# Altium project ZYNQ7020.PrjPcb (part 2 of 3)

## Sheet DDR.SchDoc
size A3
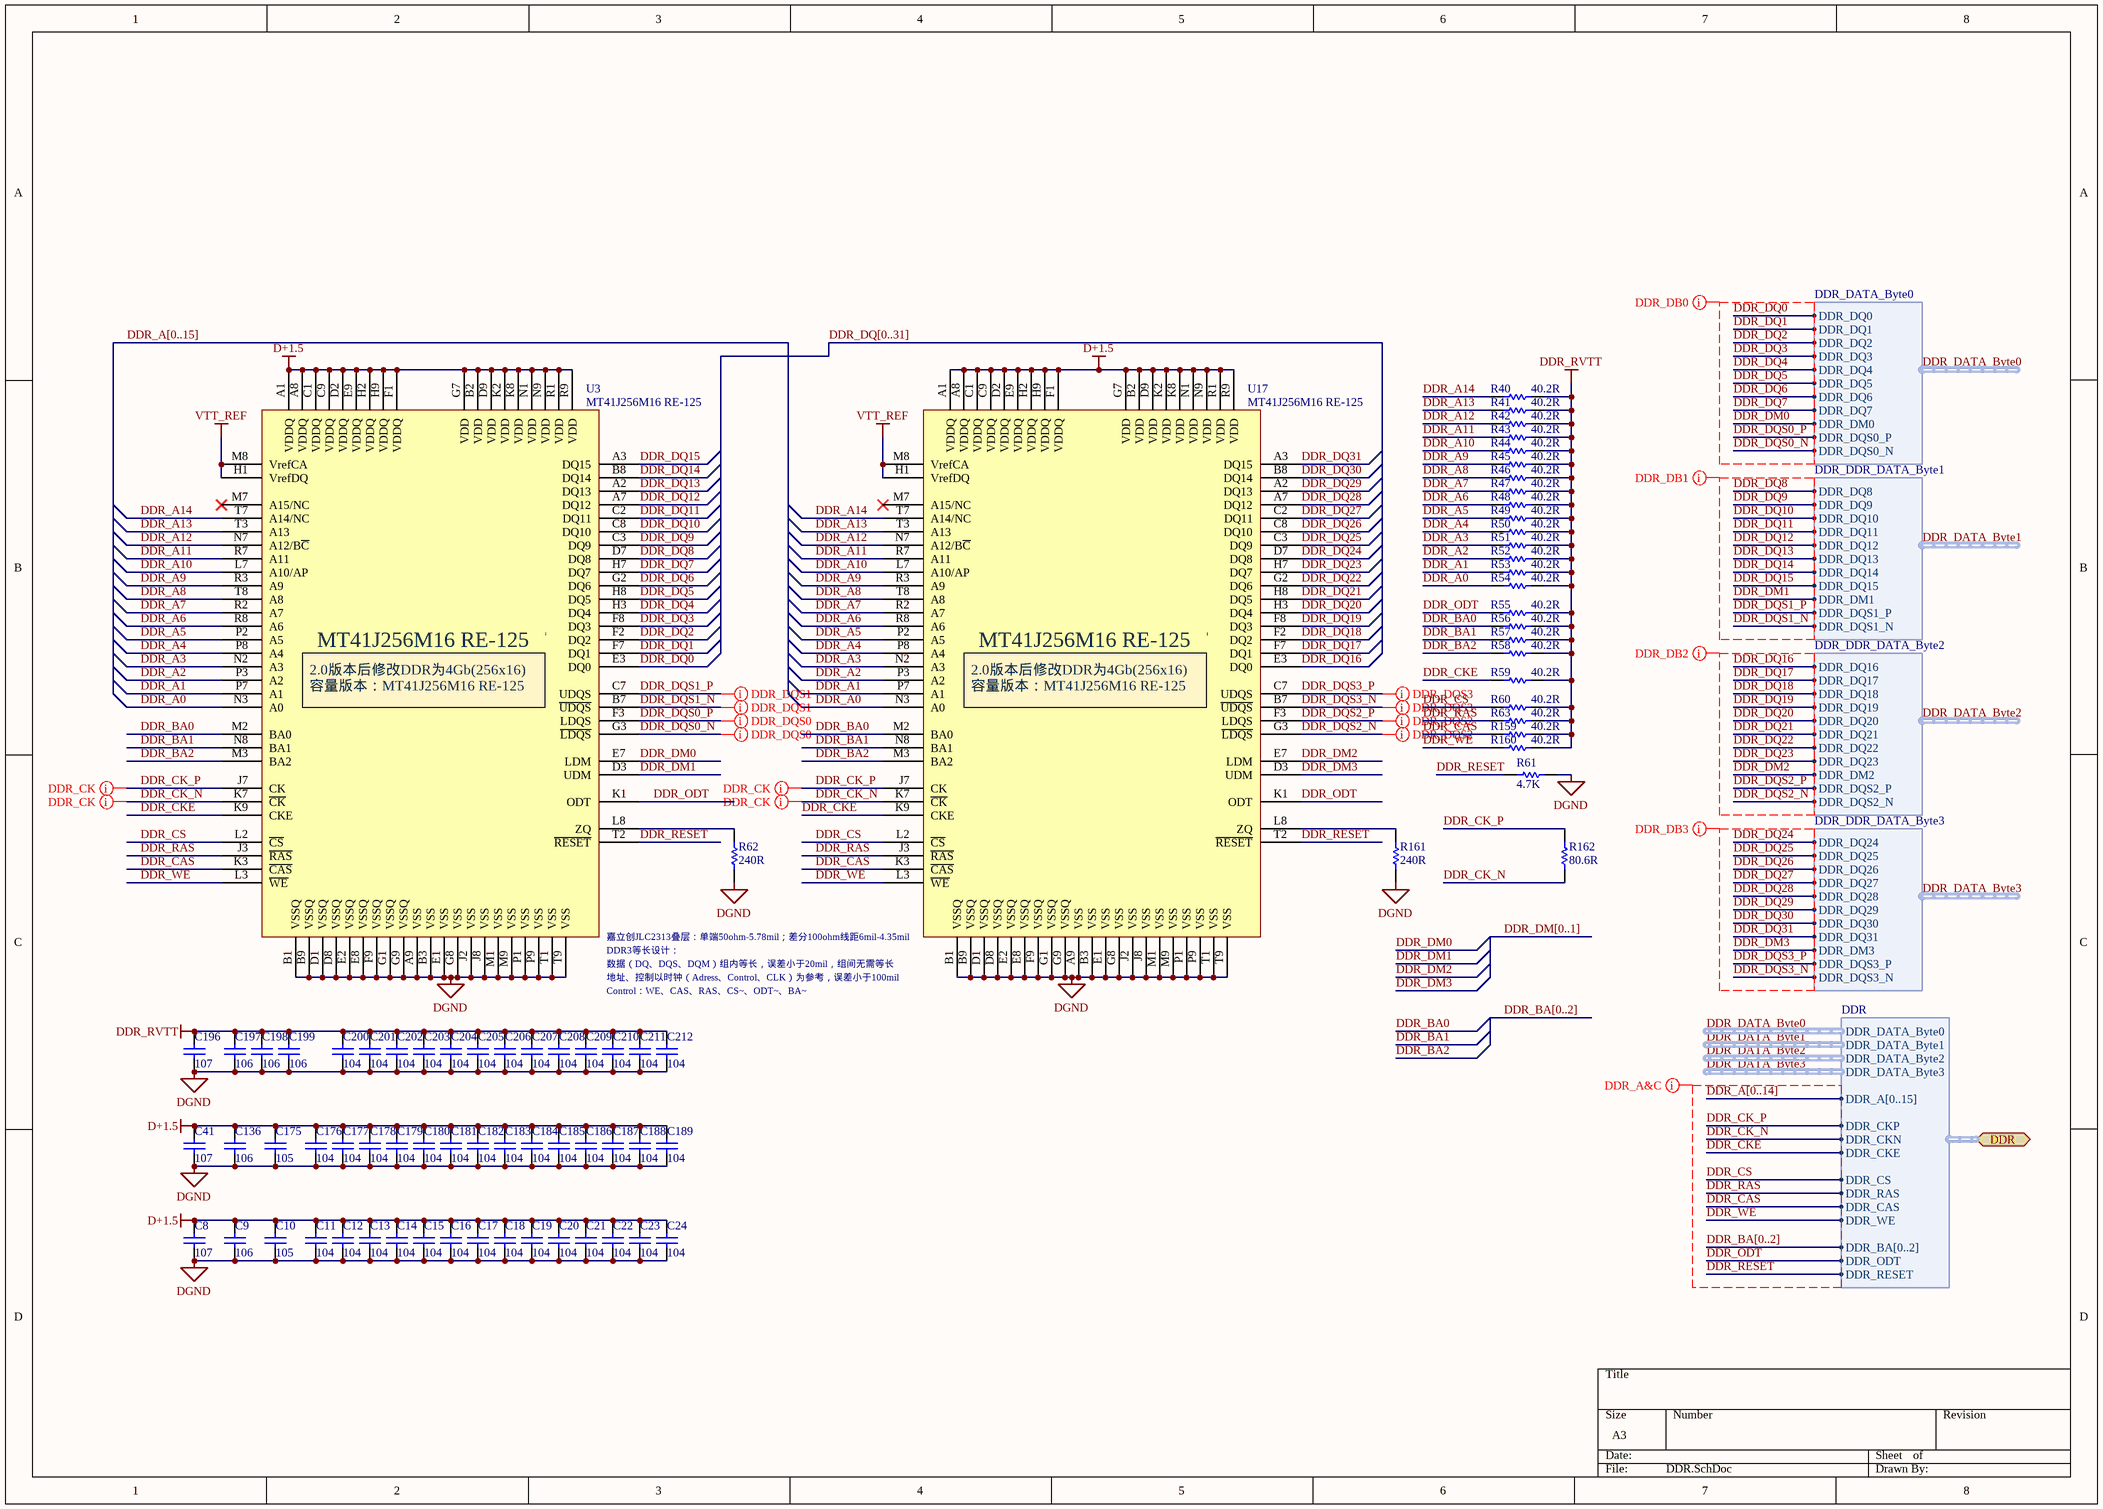
[diagram p8: DDR.SchDoc]

### Parts
C8  107  [C 1206_L]
C9  106  [C 0603_L]
C10  105  [C 0603_L]
C11  104  [C 0402_LL]
C12  104  [C 0402_LL]
C13  104  [C 0402_LL]
C14  104  [C 0402_LL]
C15  104  [C 0402_LL]
C16  104  [C 0402_LL]
C17  104  [C 0402_LL]
C18  104  [C 0402_LL]
C19  104  [C 0402_LL]
C20  104  [C 0402_LL]
C21  104  [C 0402_LL]
C22  104  [C 0402_LL]
C23  104  [C 0402_LL]
C24  104  [C 0402_LL]
C41  107  [C 1206_L]
C136  106  [C 0603_L]
C175  105  [C 0603_L]
C176  104  [C 0402_LL]
C177  104  [C 0402_LL]
C178  104  [C 0402_LL]
C179  104  [C 0402_LL]
C180  104  [C 0402_LL]
C181  104  [C 0402_LL]
C182  104  [C 0402_LL]
C183  104  [C 0402_LL]
C184  104  [C 0402_LL]
C185  104  [C 0402_LL]
C186  104  [C 0402_LL]
C187  104  [C 0402_LL]
C188  104  [C 0402_LL]
C189  104  [C 0402_LL]
C196  107  [C 1206_L]
C197  106  [C 0603_L]
C198  106  [C 0603_L]
C199  106  [C 0603_L]
C200  104  [C 0402_LL]
C201  104  [C 0402_LL]
C202  104  [C 0402_LL]
C203  104  [C 0402_LL]
C204  104  [C 0402_LL]
C205  104  [C 0402_LL]
C206  104  [C 0402_LL]
C207  104  [C 0402_LL]
C208  104  [C 0402_LL]
C209  104  [C 0402_LL]
C210  104  [C 0402_LL]
C211  104  [C 0402_LL]
C212  104  [C 0402_LL]
R40  40.2R  [R 0402_L]
R41  40.2R  [R 0402_L]
R42  40.2R  [R 0402_L]
R43  40.2R  [R 0402_L]
R44  40.2R  [R 0402_L]
R45  40.2R  [R 0402_L]
R46  40.2R  [R 0402_L]
R47  40.2R  [R 0402_L]
R48  40.2R  [R 0402_L]
R49  40.2R  [R 0402_L]
R50  40.2R  [R 0402_L]
R51  40.2R  [R 0402_L]
R52  40.2R  [R 0402_L]
R53  40.2R  [R 0402_L]
R54  40.2R  [R 0402_L]
R55  40.2R  [R 0402_L]
R56  40.2R  [R 0402_L]
R57  40.2R  [R 0402_L]
R58  40.2R  [R 0402_L]
R59  40.2R  [R 0402_L]
R60  40.2R  [R 0402_L]
R61  4.7K  [R 0402_L]
R62  240R  [R 0603_L]
R63  40.2R  [R 0402_L]
R159  40.2R  [R 0402_L]
R160  40.2R  [R 0402_L]
R161  240R  [R 0603_L]
R162  80.6R  [R 0402_L]
U3  MT41J256M16 RE-125  [FBGA96]
U17  MT41J256M16 RE-125  [FBGA96]

### Ports
DDR (bidir, harness DDR)

### Harnesses
DDR: DDR_A[0..15], DDR_CKP, DDR_CKN, DDR_CKE, DDR_CS, DDR_RAS, DDR_CAS, DDR_WE, DDR_DATA_Byte0, DDR_DATA_Byte1, DDR_DATA_Byte2, DDR_DATA_Byte3, DDR_BA[0..2], DDR_ODT, DDR_RESET
DDR_DDR_DATA_Byte3: DDR_DQ24, DDR_DQ25, DDR_DQ26, DDR_DQ27, DDR_DQ28, DDR_DQ29, DDR_DQ30, DDR_DQ31, DDR_DM3, DDR_DQS3_P, DDR_DQS3_N
DDR_DDR_DATA_Byte2: DDR_DQ16, DDR_DQ17, DDR_DQ18, DDR_DQ19, DDR_DQ20, DDR_DQ21, DDR_DQ22, DDR_DQ23, DDR_DM2, DDR_DQS2_P, DDR_DQS2_N
DDR_DDR_DATA_Byte1: DDR_DQ8, DDR_DQ9, DDR_DQ10, DDR_DQ11, DDR_DQ12, DDR_DQ13, DDR_DQ14, DDR_DQ15, DDR_DM1, DDR_DQS1_P, DDR_DQS1_N
DDR_DATA_Byte0: DDR_DQ0, DDR_DQ1, DDR_DQ2, DDR_DQ3, DDR_DQ4, DDR_DQ5, DDR_DQ6, DDR_DQ7, DDR_DM0, DDR_DQS0_P, DDR_DQS0_N

### Nets
D+1.5: C8.2 C9.2 C10.2 C11.2 C12.2 C13.2 C14.2 C15.2 C16.2 C17.2 C18.2 C19.2 C20.2 C21.2 C22.2 C23.2 C24.2 C41.2 C136.2 C175.2 C176.2 C177.2 C178.2 C179.2 C180.2 C181.2 C182.2 C183.2 C184.2 C185.2 C186.2 C187.2 C188.2 C189.2 U3.A1(VDDQ) U3.A8(VDDQ) U3.B2(VDD) U3.C1(VDDQ) U3.C9(VDDQ) U3.D2(VDDQ) U3.D9(VDD) U3.E9(VDDQ) U3.F1(VDDQ) U3.G7(VDD) U3.H2(VDDQ) U3.H9(VDDQ) U3.K2(VDD) U3.K8(VDD) U3.N1(VDD) U3.N9(VDD) U3.R1(VDD) U3.R9(VDD) U17.A1(VDDQ) U17.A8(VDDQ) U17.B2(VDD) U17.C1(VDDQ) U17.C9(VDDQ) U17.D2(VDDQ) U17.D9(VDD) U17.E9(VDDQ) U17.F1(VDDQ) U17.G7(VDD) U17.H2(VDDQ) U17.H9(VDDQ) U17.K2(VDD) U17.K8(VDD) U17.N1(VDD) U17.N9(VDD) U17.R1(VDD) U17.R9(VDD)
DDR_RVTT: C196.2 C197.2 C198.2 C199.2 C200.2 C201.2 C202.2 C203.2 C204.2 C205.2 C206.2 C207.2 C208.2 C209.2 C210.2 C211.2 C212.2 R40.2 R41.2 R42.2 R43.2 R44.2 R45.2 R46.2 R47.2 R48.2 R49.2 R50.2 R51.2 R52.2 R53.2 R54.2 R55.1 R56.2 R57.2 R58.2 R59.2 R60.2 R63.2 R159.2 R160.2
DGND: C8.1 C9.1 C10.1 C11.1 C12.1 C13.1 C14.1 C15.1 C16.1 C17.1 C18.1 C19.1 C20.1 C21.1 C22.1 C23.1 C24.1 C41.1 C136.1 C175.1 C176.1 C177.1 C178.1 C179.1 C180.1 C181.1 C182.1 C183.1 C184.1 C185.1 C186.1 C187.1 C188.1 C189.1 C196.1 C197.1 C198.1 C199.1 C200.1 C201.1 C202.1 C203.1 C204.1 C205.1 C206.1 C207.1 C208.1 C209.1 C210.1 C211.1 C212.1 R61.1 R62.1 R161.1 U3.A9(VSS) U3.B1(VSSQ) U3.B3(VSS) U3.B9(VSSQ) U3.D1(VSSQ) U3.D8(VSSQ) U3.E1(VSS) U3.E2(VSSQ) U3.E8(VSSQ) U3.F9(VSSQ) U3.G1(VSSQ) U3.G8(VSS) U3.G9(VSSQ) U3.J2(VSS) U3.J8(VSS) U3.M1(VSS) U3.M9(VSS) U3.P1(VSS) U3.P9(VSS) U3.T1(VSS) U3.T9(VSS) U17.A9(VSS) U17.B1(VSSQ) U17.B3(VSS) U17.B9(VSSQ) U17.D1(VSSQ) U17.D8(VSSQ) U17.E1(VSS) U17.E2(VSSQ) U17.E8(VSSQ) U17.F9(VSSQ) U17.G1(VSSQ) U17.G8(VSS) U17.G9(VSSQ) U17.J2(VSS) U17.J8(VSS) U17.M1(VSS) U17.M9(VSS) U17.P1(VSS) U17.P9(VSS) U17.T1(VSS) U17.T9(VSS)
VTT_REF: U3.H1(VrefDQ) U3.M8(VrefCA) U17.H1(VrefDQ) U17.M8(VrefCA)
DDR_A0: R54.1 U3.N3(A0) U17.N3(A0)
DDR_A1: R53.1 U3.P7(A1) U17.P7(A1)
DDR_A2: R52.1 U3.P3(A2) U17.P3(A2)
DDR_A3: R51.1 U3.N2(A3) U17.N2(A3)
DDR_A4: R50.1 U3.P8(A4) U17.P8(A4)
DDR_A5: R49.1 U3.P2(A5) U17.P2(A5)
DDR_A6: R48.1 U3.R8(A6) U17.R8(A6)
DDR_A7: R47.1 U3.R2(A7) U17.R2(A7)
DDR_A8: R46.1 U3.T8(A8) U17.T8(A8)
DDR_A9: R45.1 U3.R3(A9) U17.R3(A9)
DDR_A10: R44.1 U3.L7(A10/AP) U17.L7(A10/AP)
DDR_A11: R43.1 U3.R7(A11) U17.R7(A11)
DDR_A12: R42.1 U3.N7(A12/B~{C}) U17.N7(A12/B~{C})
DDR_A13: R41.1 U3.T3(A13) U17.T3(A13)
DDR_A14: R40.1 U3.T7(A14/NC) U17.T7(A14/NC)
DDR_BA0: R56.1 U3.M2(BA0) U17.M2(BA0)
DDR_BA1: R57.1 U3.N8(BA1) U17.N8(BA1)
DDR_BA2: R58.1 U3.M3(BA2) U17.M3(BA2)
DDR_CAS: R159.1 U3.K3(~{CAS}) U17.K3(~{CAS}) ; port DDR.DDR_CAS
DDR_CK_N: R162.2 U3.K7(~{CK}) U17.K7(~{CK}) ; port DDR.DDR_CKN
DDR_CK_P: R162.1 U3.J7(CK) U17.J7(CK) ; port DDR.DDR_CKP
DDR_CKE: R59.1 U3.K9(CKE) U17.K9(CKE) ; port DDR.DDR_CKE
DDR_CS: R60.1 U3.L2(~{CS}) U17.L2(~{CS}) ; port DDR.DDR_CS
DDR_DM0: U3.E7(LDM) ; harness DDR_DATA_Byte0.DDR_DM0  [project net DDR_DATA_Byte0.DDR_DM0]
DDR_DM1: U3.D3(UDM) ; harness DDR_DDR_DATA_Byte1.DDR_DM1  [project net DDR_DATA_Byte1.DDR_DM1]
DDR_DM2: U17.E7(LDM) ; harness DDR_DDR_DATA_Byte2.DDR_DM2  [project net DDR_DATA_Byte2.DDR_DM2]
DDR_DM3: U17.D3(UDM) ; harness DDR_DDR_DATA_Byte3.DDR_DM3  [project net DDR_DATA_Byte3.DDR_DM3]
DDR_DQ0: U3.E3(DQ0) ; harness DDR_DATA_Byte0.DDR_DQ0  [project net DDR_DATA_Byte0.DDR_DQ0]
DDR_DQ1: U3.F7(DQ1) ; harness DDR_DATA_Byte0.DDR_DQ1  [project net DDR_DATA_Byte0.DDR_DQ1]
DDR_DQ2: U3.F2(DQ2) ; harness DDR_DATA_Byte0.DDR_DQ2  [project net DDR_DATA_Byte0.DDR_DQ2]
DDR_DQ3: U3.F8(DQ3) ; harness DDR_DATA_Byte0.DDR_DQ3  [project net DDR_DATA_Byte0.DDR_DQ3]
DDR_DQ4: U3.H3(DQ4) ; harness DDR_DATA_Byte0.DDR_DQ4  [project net DDR_DATA_Byte0.DDR_DQ4]
DDR_DQ5: U3.H8(DQ5) ; harness DDR_DATA_Byte0.DDR_DQ5  [project net DDR_DATA_Byte0.DDR_DQ5]
DDR_DQ6: U3.G2(DQ6) ; harness DDR_DATA_Byte0.DDR_DQ6  [project net DDR_DATA_Byte0.DDR_DQ6]
DDR_DQ7: U3.H7(DQ7) ; harness DDR_DATA_Byte0.DDR_DQ7  [project net DDR_DATA_Byte0.DDR_DQ7]
DDR_DQ8: U3.D7(DQ8) ; harness DDR_DDR_DATA_Byte1.DDR_DQ8  [project net DDR_DATA_Byte1.DDR_DQ8]
DDR_DQ9: U3.C3(DQ9) ; harness DDR_DDR_DATA_Byte1.DDR_DQ9  [project net DDR_DATA_Byte1.DDR_DQ9]
DDR_DQ10: U3.C8(DQ10) ; harness DDR_DDR_DATA_Byte1.DDR_DQ10  [project net DDR_DATA_Byte1.DDR_DQ10]
DDR_DQ11: U3.C2(DQ11) ; harness DDR_DDR_DATA_Byte1.DDR_DQ11  [project net DDR_DATA_Byte1.DDR_DQ11]
DDR_DQ12: U3.A7(DQ12) ; harness DDR_DDR_DATA_Byte1.DDR_DQ12  [project net DDR_DATA_Byte1.DDR_DQ12]
DDR_DQ13: U3.A2(DQ13) ; harness DDR_DDR_DATA_Byte1.DDR_DQ13  [project net DDR_DATA_Byte1.DDR_DQ13]
DDR_DQ14: U3.B8(DQ14) ; harness DDR_DDR_DATA_Byte1.DDR_DQ14  [project net DDR_DATA_Byte1.DDR_DQ14]
DDR_DQ15: U3.A3(DQ15) ; harness DDR_DDR_DATA_Byte1.DDR_DQ15  [project net DDR_DATA_Byte1.DDR_DQ15]
DDR_DQ16: U17.E3(DQ0) ; harness DDR_DDR_DATA_Byte2.DDR_DQ16  [project net DDR_DATA_Byte2.DDR_DQ16]
DDR_DQ17: U17.F7(DQ1) ; harness DDR_DDR_DATA_Byte2.DDR_DQ17  [project net DDR_DATA_Byte2.DDR_DQ17]
DDR_DQ18: U17.F2(DQ2) ; harness DDR_DDR_DATA_Byte2.DDR_DQ18  [project net DDR_DATA_Byte2.DDR_DQ18]
DDR_DQ19: U17.F8(DQ3) ; harness DDR_DDR_DATA_Byte2.DDR_DQ19  [project net DDR_DATA_Byte2.DDR_DQ19]
DDR_DQ20: U17.H3(DQ4) ; harness DDR_DDR_DATA_Byte2.DDR_DQ20  [project net DDR_DATA_Byte2.DDR_DQ20]
DDR_DQ21: U17.H8(DQ5) ; harness DDR_DDR_DATA_Byte2.DDR_DQ21  [project net DDR_DATA_Byte2.DDR_DQ21]
DDR_DQ22: U17.G2(DQ6) ; harness DDR_DDR_DATA_Byte2.DDR_DQ22  [project net DDR_DATA_Byte2.DDR_DQ22]
DDR_DQ23: U17.H7(DQ7) ; harness DDR_DDR_DATA_Byte2.DDR_DQ23  [project net DDR_DATA_Byte2.DDR_DQ23]
DDR_DQ24: U17.D7(DQ8) ; harness DDR_DDR_DATA_Byte3.DDR_DQ24  [project net DDR_DATA_Byte3.DDR_DQ24]
DDR_DQ25: U17.C3(DQ9) ; harness DDR_DDR_DATA_Byte3.DDR_DQ25  [project net DDR_DATA_Byte3.DDR_DQ25]
DDR_DQ26: U17.C8(DQ10) ; harness DDR_DDR_DATA_Byte3.DDR_DQ26  [project net DDR_DATA_Byte3.DDR_DQ26]
DDR_DQ27: U17.C2(DQ11) ; harness DDR_DDR_DATA_Byte3.DDR_DQ27  [project net DDR_DATA_Byte3.DDR_DQ27]
DDR_DQ28: U17.A7(DQ12) ; harness DDR_DDR_DATA_Byte3.DDR_DQ28  [project net DDR_DATA_Byte3.DDR_DQ28]
DDR_DQ29: U17.A2(DQ13) ; harness DDR_DDR_DATA_Byte3.DDR_DQ29  [project net DDR_DATA_Byte3.DDR_DQ29]
DDR_DQ30: U17.B8(DQ14) ; harness DDR_DDR_DATA_Byte3.DDR_DQ30  [project net DDR_DATA_Byte3.DDR_DQ30]
DDR_DQ31: U17.A3(DQ15) ; harness DDR_DDR_DATA_Byte3.DDR_DQ31  [project net DDR_DATA_Byte3.DDR_DQ31]
DDR_DQS0_N: U3.G3(~{LDQS}) ; harness DDR_DATA_Byte0.DDR_DQS0_N  [project net DDR_DATA_Byte0.DDR_DQS0_N]
DDR_DQS0_P: U3.F3(LDQS) ; harness DDR_DATA_Byte0.DDR_DQS0_P  [project net DDR_DATA_Byte0.DDR_DQS0_P]
DDR_DQS1_N: U3.B7(~{UDQS}) ; harness DDR_DDR_DATA_Byte1.DDR_DQS1_N  [project net DDR_DATA_Byte1.DDR_DQS1_N]
DDR_DQS1_P: U3.C7(UDQS) ; harness DDR_DDR_DATA_Byte1.DDR_DQS1_P  [project net DDR_DATA_Byte1.DDR_DQS1_P]
DDR_DQS2_N: U17.G3(~{LDQS}) ; harness DDR_DDR_DATA_Byte2.DDR_DQS2_N  [project net DDR_DATA_Byte2.DDR_DQS2_N]
DDR_DQS2_P: U17.F3(LDQS) ; harness DDR_DDR_DATA_Byte2.DDR_DQS2_P  [project net DDR_DATA_Byte2.DDR_DQS2_P]
DDR_DQS3_N: U17.B7(~{UDQS}) ; harness DDR_DDR_DATA_Byte3.DDR_DQS3_N  [project net DDR_DATA_Byte3.DDR_DQS3_N]
DDR_DQS3_P: U17.C7(UDQS) ; harness DDR_DDR_DATA_Byte3.DDR_DQS3_P  [project net DDR_DATA_Byte3.DDR_DQS3_P]
DDR_ODT: R55.2 U3.K1(ODT) U17.K1(ODT) ; port DDR.DDR_ODT
DDR_RAS: R63.1 U3.J3(~{RAS}) U17.J3(~{RAS}) ; port DDR.DDR_RAS
DDR_RESET: R61.2 U3.T2(~{RESET}) U17.T2(~{RESET}) ; port DDR.DDR_RESET
DDR_WE: R160.1 U3.L3(~{WE}) U17.L3(~{WE}) ; port DDR.DDR_WE
NetR62_2: R62.2 U3.L8(ZQ)
NetR161_2: R161.2 U17.L8(ZQ)

Not connected (* = marked no-connect by the designer): U3 J1 J9 L1 L9 M7(A15/NC)*; U17 J1 J9 L1 L9 M7(A15/NC)*

### Buses and harness runs
bus DDR_A[0..14]
bus DDR_A[0..15]
bus DDR_BA[0..2]
bus DDR_DM[0..1]
bus DDR_DQ[0..31]

### Layout directives
differential pair; differential pair class DDR_DQS1: DDR_DATA_Byte1.DDR_DQS1_N, DDR_DATA_Byte1.DDR_DQS1_P
differential pair; differential pair class DDR_DQS3: DDR_DATA_Byte3.DDR_DQS3_N, DDR_DATA_Byte3.DDR_DQS3_P
differential pair; differential pair class DDR_DQS0: DDR_CK_N, DDR_CK_P, DDR_DATA_Byte0.DDR_DQS0_N, DDR_DATA_Byte0.DDR_DQS0_P
differential pair; differential pair class DDR_DQS2: DDR_DATA_Byte2.DDR_DQS2_N, DDR_DATA_Byte2.DDR_DQS2_P
net class DDR_DB0: DDR_DM0, DDR_DQ0, DDR_DQ1, DDR_DQ2, DDR_DQ3, DDR_DQ4, DDR_DQ5, DDR_DQ6, DDR_DQ7, DDR_DQS0_N, DDR_DQS0_P
net class DDR_DB1: DDR_DM1, DDR_DQ8, DDR_DQ9, DDR_DQ10, DDR_DQ11, DDR_DQ12, DDR_DQ13, DDR_DQ14, DDR_DQ15, DDR_DQS1_N, DDR_DQS1_P
net class DDR_DB2: DDR_DM2, DDR_DQ16, DDR_DQ17, DDR_DQ18, DDR_DQ19, DDR_DQ20, DDR_DQ21, DDR_DQ22, DDR_DQ23, DDR_DQS2_N, DDR_DQS2_P
net class DDR_DB3: DDR_DM3, DDR_DQ24, DDR_DQ25, DDR_DQ26, DDR_DQ27, DDR_DQ28, DDR_DQ29, DDR_DQ30, DDR_DQ31, DDR_DQS3_N, DDR_DQS3_P
net class DDR_A&C: DDR_A[0..14], DDR_BA[0..2], DDR_CAS, DDR_CK_N, DDR_CK_P, DDR_CKE, DDR_CS, DDR_ODT, DDR_RAS, DDR_RESET, DDR_WE

### Notes on the sheet
- (near U3) MT41J256M16 RE-125
- (near U17) MT41J256M16 RE-125
- (near U3) 2.0版本后修改DDR为4Gb(256x16)容量版本：MT41J256M16 RE-125
- (near U17) 2.0版本后修改DDR为4Gb(256x16)容量版本：MT41J256M16 RE-125
- (near U3) 嘉立创JLC2313叠层：单端50ohm-5.78mil；差分100ohm线距6mil-4.35mil
- (near U3) DDR3等长设计：
- (near U3) 数据（DQ、DQS、DQM）组内等长，误差小于20mil，组间无需等长
- (near U3) 地址、控制以时钟（Adress、Control、CLK）为参考，误差小于100mil
- Control：WE、CAS、RAS、CS~、ODT~、BA~

### Library data of the parts
C8-C24 C41 C136 C175-C189 C196-C212 = Cap: Capacitor; Published: 8-Jun-2000; LatestRevisionDate: 17-Jul-2002; LatestRevisionNote: Re-released for DXP Platform.; PackageReference: RAD-0.3; Publisher: Altium Limited; PackageDescription: Radial Cap, Thru-Hole; 2 Leads; 0.3 in Pin Spacing
R40-R63 R159-R162 = Res1: Resistor; Value: 1K; Published: 8-Jun-2000; LatestRevisionDate: 17-Jul-2002; LatestRevisionNote: Re-released for DXP Platform.; PackageReference: AXIAL-0.3; Publisher: Altium Limited; PackageDescription: Axial Device, Thru-Hole; 2 Leads; 0.3 in Pin Spacing
U3 U17 = MT41J128M16HA-125 IT: DDR3，存储芯片; Manufacturer: Micron; value: NC

## Sheet Human_Interface.SchDoc
size A4
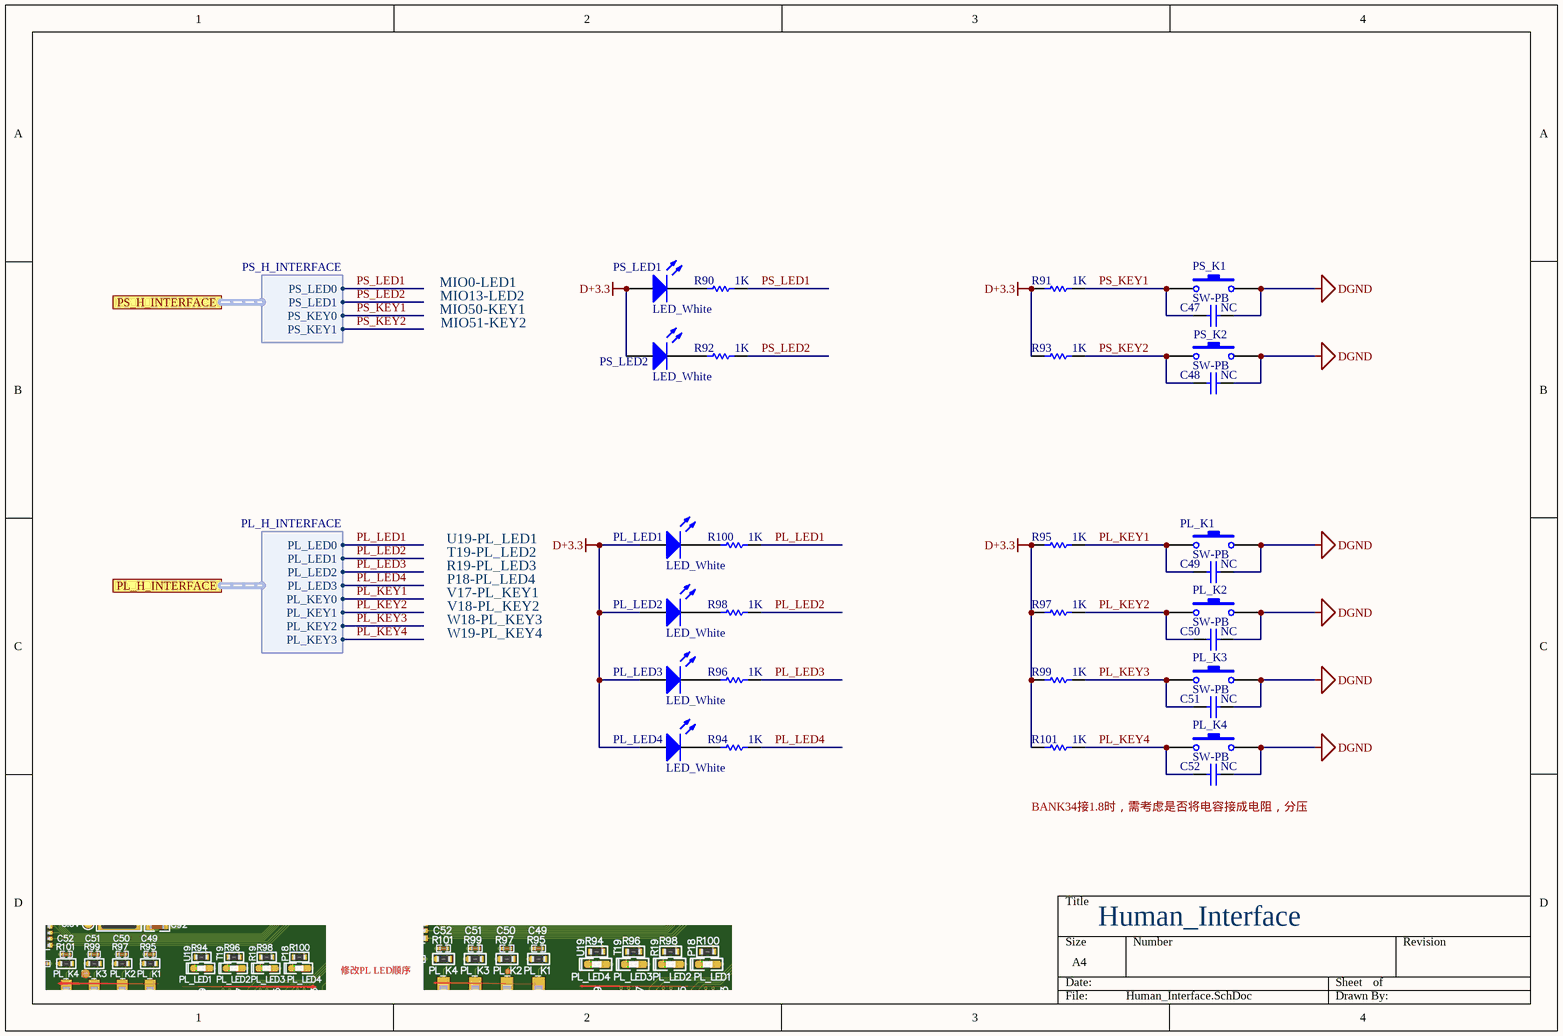
[diagram p9: Human_Interface.SchDoc]

### Parts
C47  NC  [C 0402_LL]
C48  NC  [C 0402_LL]
C49  NC  [C 0402_LL]
C50  NC  [C 0402_LL]
C51  NC  [C 0402_LL]
C52  NC  [C 0402_LL]
PL_K1  SW-PB  [TSW SMD-3*6*4.3]
PL_K2  SW-PB  [TSW SMD-3*6*4.3]
PL_K3  SW-PB  [TSW SMD-3*6*4.3]
PL_K4  SW-PB  [TSW SMD-3*6*4.3]
PL_LED1  LED_White  [LED 0603W]
PL_LED2  LED_White  [LED 0603W]
PL_LED3  LED_White  [LED 0603W]
PL_LED4  LED_White  [LED 0603W]
PS_K1  SW-PB  [TSW SMD-3*6*4.3]
PS_K2  SW-PB  [TSW SMD-3*6*4.3]
PS_LED1  LED_White  [LED 0603W]
PS_LED2  LED_White  [LED 0603W]
R90  1K  [R 0603_L]
R91  1K  [R 0603_L]
R92  1K  [R 0603_L]
R93  1K  [R 0603_L]
R94  1K  [R 0603_L]
R95  1K  [R 0603_L]
R96  1K  [R 0603_L]
R97  1K  [R 0603_L]
R98  1K  [R 0603_L]
R99  1K  [R 0603_L]
R100  1K  [R 0603_L]
R101  1K  [R 0603_L]

### Ports
PL_H_INTERFACE (harness PL_H_INTERFACE), PS_H_INTERFACE (harness PS_H_INTERFACE)

### Harnesses
PS_H_INTERFACE: PS_LED0, PS_LED1, PS_KEY0, PS_KEY1
PL_H_INTERFACE: PL_LED0, PL_LED1, PL_KEY0, PL_KEY1, PL_LED2, PL_LED3, PL_KEY2, PL_KEY3

### Nets
D+3.3: PL_LED1.1(A) PL_LED2.1(A) PL_LED3.1(A) PL_LED4.1(A) PS_LED1.1(A) PS_LED2.1(A) R91.2 R93.2 R95.2 R97.2 R99.2 R101.2
DGND: C47.1 C48.1 C49.1 C50.1 C51.1 C52.1 PL_K1.2 PL_K2.2 PL_K3.2 PL_K4.2 PS_K1.2 PS_K2.2
PL_KEY1: C49.2 PL_K1.1 R95.1 ; port PL_H_INTERFACE.PL_KEY0  [project net BANK34_L21_P]
PL_KEY2: C50.2 PL_K2.1 R97.1 ; port PL_H_INTERFACE.PL_KEY1  [project net BANK34_L21_N]
PL_KEY3: C51.2 PL_K3.1 R99.1 ; port PL_H_INTERFACE.PL_KEY2  [project net BANK34_L22_P]
PL_KEY4: C52.2 PL_K4.1 R101.1 ; port PL_H_INTERFACE.PL_KEY3  [project net BANK34_L22_N]
PL_LED1: R100.1 ; port PL_H_INTERFACE.PL_LED0  [project net BANK34_L23_N]
PL_LED2: R98.1 ; port PL_H_INTERFACE.PL_LED1  [project net BANK34_0]
PL_LED3: R96.1 ; port PL_H_INTERFACE.PL_LED2  [project net BANK34_25]
PL_LED4: R94.1 ; port PL_H_INTERFACE.PL_LED3  [project net BANK34_L12_N]
PS_KEY1: C47.2 PS_K1.1 R91.1 ; port PS_H_INTERFACE.PS_KEY0
PS_KEY2: C48.2 PS_K2.1 R93.1 ; port PS_H_INTERFACE.PS_KEY1
PS_LED1: R90.1 ; port PS_H_INTERFACE.PS_LED0
PS_LED2: R92.1 ; port PS_H_INTERFACE.PS_LED1
NetPL_LED1_2: PL_LED1.2(K) R100.2
NetPL_LED2_2: PL_LED2.2(K) R98.2
NetPL_LED3_2: PL_LED3.2(K) R96.2
NetPL_LED4_2: PL_LED4.2(K) R94.2
NetPS_LED1_2: PS_LED1.2(K) R90.2
NetPS_LED2_2: PS_LED2.2(K) R92.2

### Notes on the sheet
- MIO0-LED1
- MIO13-LED2
- MIO50-KEY1
- MIO51-KEY2
- P18-PL_LED4
- T19-PL_LED2
- R19-PL_LED3
- U19-PL_LED1
- V17-PL_KEY1
- V18-PL_KEY2
- W18-PL_KEY3
- W19-PL_KEY4
- (near C52) BANK34接1.8时，需考虑是否将电容接成电阻，分压
- Human_Interface
- 修改PL LED顺序

### Library data of the parts
C47-C52 = Cap: Capacitor; Published: 8-Jun-2000; LatestRevisionDate: 17-Jul-2002; LatestRevisionNote: Re-released for DXP Platform.; PackageReference: RAD-0.3; Publisher: Altium Limited; PackageDescription: Radial Cap, Thru-Hole; 2 Leads; 0.3 in Pin Spacing
PL_K1-PL_K4 PS_K1 PS_K2 = SW-PB: Switch; Published: 24-Mar-1999; LatestRevisionDate: 17-Jul-2002; LatestRevisionNote: Re-released for DXP Platform.; PackageReference: SPST-2; Publisher: Altium Limited; PackageDescription: Switch; 2 Leads
PL_LED1-PL_LED4 PS_LED1 PS_LED2 = LED0: Typical INFRARED GaAs LED; Published: 8-Jun-2000; LatestRevisionDate: 08-Jul-2005; LatestRevisionNote: Mech Layer 1 removed.; PackageReference: LED-0; Publisher: Altium Limited; PackageDescription: LED; 2 Leads
R90-R101 = Res1: Resistor; Published: 8-Jun-2000; LatestRevisionDate: 17-Jul-2002; LatestRevisionNote: Re-released for DXP Platform.; PackageReference: AXIAL-0.3; Publisher: Altium Limited; PackageDescription: Axial Device, Thru-Hole; 2 Leads; 0.3 in Pin Spacing; Value: 1K

## Sheet UART.SchDoc
size A4
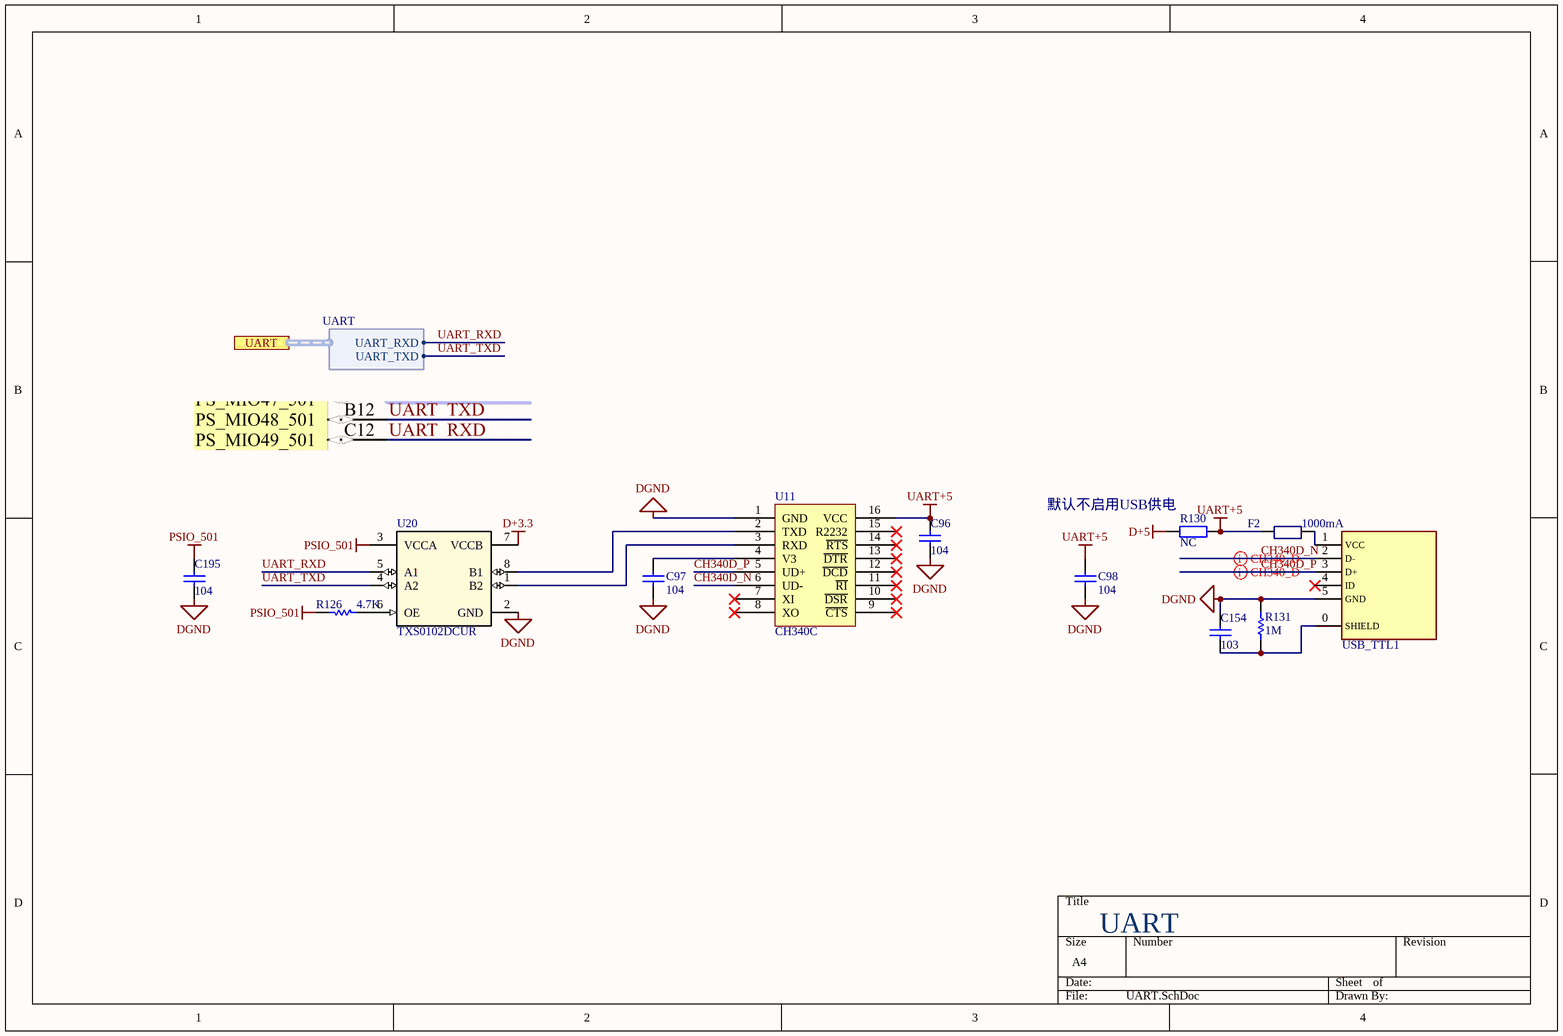
[diagram p10: UART.SchDoc]

### Parts
C96  104  [C 0402_LL]
C97  104  [C 0402_LL]
C98  104  [C 0402_LL]
C154  103  [C 0603_L]
C195  104  [C 0402_LL]
F2  1000mA  [FU 0805]
R126  4.7K  [R 0603_L]
R130  NC  [R 1206_L]
R131  1M  [R 0603_L]
U11  CH340C  [SOP16_L]
U20  TXS0102DCUR  [DCU0008A_N]
USB_TTL1  USB_miniB,microB  [USB-MINI-A]  (value not drawn)

### Ports
UART (harness UART)

### Harnesses
UART: UART_RXD, UART_TXD

### Nets
D+3.3: U20.7(VCCB)
D+5: R130.2
DGND: C96.1 C97.2 C98.1 C154.1 C195.1 R131.2 U11.1(GND) U20.2(GND) USB_TTL1.5(GND)
PSIO_501: C195.2 R126.2 U20.3(VCCA)  [project net D+1.8_AUX]
UART+5: C96.2 C98.2 F2.1 R130.1 U11.16(VCC)
CH340D_N: U11.6(UD-) USB_TTL1.2(D-)
CH340D_P: U11.5(UD+) USB_TTL1.3(D+)
UART_RXD: U20.5(A1) ; port UART.UART_RXD
UART_TXD: U20.4(A2) ; port UART.UART_TXD
NetC97_1: C97.1 U11.4(V3)
NetC154_2: C154.2 R131.1 USB_TTL1.0(SHIELD)
NetF2_2: F2.2 USB_TTL1.1(VCC)
NetR126_1: R126.1 U20.6(OE)
NetU11_2: U11.2(TXD) U20.8(B1)
NetU11_3: U11.3(RXD) U20.1(B2)

Not connected (* = marked no-connect by the designer): U11 7(XI)* 8(XO)* 9(~{CTS})* 10(~{DSR})* 11(~{RI})* 12(~{DCD})* 13(~{DTR})* 14(~{RTS})* 15(R2232)*; USB_TTL1 4(ID)*

### Layout directives
differential pair; differential pair class CH340D: CH340D_N, CH340D_P

### Notes on the sheet
- (near R130) 默认不启用USB供电
- UART

### Library data of the parts
C96-C98 C195 = Cap: Capacitor; Value: 100pF; Published: 8-Jun-2000; LatestRevisionDate: 17-Jul-2002; LatestRevisionNote: Re-released for DXP Platform.; PackageReference: RAD-0.3; Publisher: Altium Limited; PackageDescription: Radial Cap, Thru-Hole; 2 Leads; 0.3 in Pin Spacing
C154 = Cap: Capacitor; Published: 8-Jun-2000; LatestRevisionDate: 17-Jul-2002; LatestRevisionNote: Re-released for DXP Platform.; PackageReference: RAD-0.3; Publisher: Altium Limited; PackageDescription: Radial Cap, Thru-Hole; 2 Leads; 0.3 in Pin Spacing
F2 = PTC
R126 R131 = Res1: Resistor; Value: 1K; Published: 8-Jun-2000; LatestRevisionDate: 17-Jul-2002; LatestRevisionNote: Re-released for DXP Platform.; PackageReference: AXIAL-0.3; Publisher: Altium Limited; PackageDescription: Axial Device, Thru-Hole; 2 Leads; 0.3 in Pin Spacing
R130 = Res2: Resistor; Value: RES; Published: 8-Jun-2000; LatestRevisionDate: 17-Jul-2002; LatestRevisionNote: Re-released for DXP Platform.; PackageReference: AXIAL-0.4; Publisher: Altium Limited; PackageDescription: Axial Device, Thru-Hole; 2 Leads; 0.4 in Pin Spacing
U11 = CH340G
U20 = TXS0102DCUR: No Description Available; Mfr_Name: Texas Instruments; Type: DEV; RefDes: RefDes; Copyright: Copyright (C) 2022 Ultra Librarian. All rights reserved.; Manufacturer_Part_Number: TXS0102DCUR

## Sheet SD_Card.SchDoc
size A4
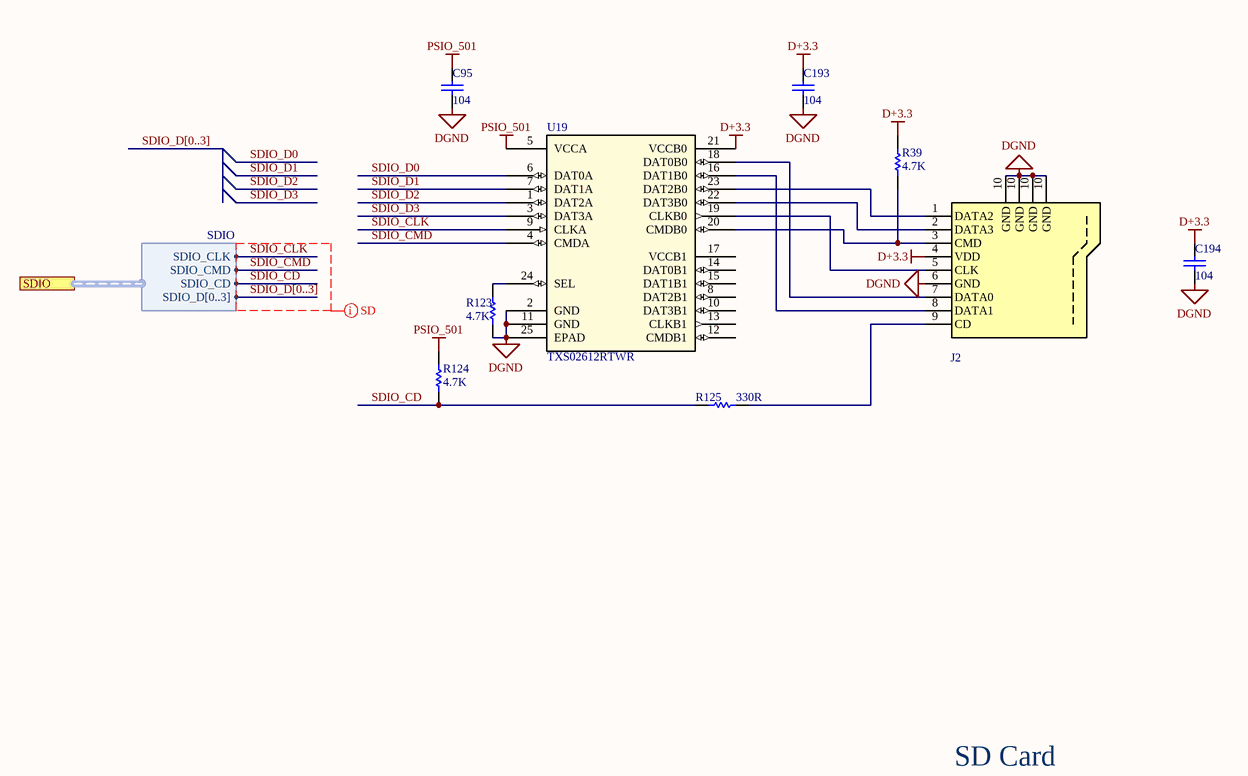
[diagram p11: SD_Card.SchDoc]

### Parts
C95  104  [C 0402_LL]
C193  104  [C 0402_LL]
C194  104  [C 0402_LL]
J2  SD_Card  [Micro SD]  (value not drawn)
R39  4.7K  [R 0603_L]
R123  4.7K  [R 0603_L]
R124  4.7K  [R 0603_L]
R125  330R  [R 0603_L]
U19  TXS02612RTWR  [RTW24_2P45X2P45]

### Ports
SDIO (harness SDIO)

### Harnesses
SDIO: SDIO_CLK, SDIO_CMD, SDIO_D[0..3], SDIO_CD

### Nets
D+3.3: C193.1 C194.1 J2.4(VDD) R39.1 U19.21(VCCB0)
DGND: C95.2 C193.2 C194.2 J2.6(GND) J2.10(GND) R123.2 U19.2(GND) U19.11(GND) U19.25(EPAD)
PSIO_501: C95.1 R124.1 U19.5(VCCA)  [project net D+1.8_AUX]
SDIO_CD: R124.2 R125.1 ; port SDIO.SDIO_CD
SDIO_CLK: U19.9(CLKA) ; port SDIO.SDIO_CLK
SDIO_CMD: U19.4(CMDA) ; port SDIO.SDIO_CMD
SDIO_D0: U19.6(DAT0A)
SDIO_D1: U19.7(DAT1A)
SDIO_D2: U19.1(DAT2A)
SDIO_D3: U19.3(DAT3A)
NetJ2_1: J2.1(DATA2) U19.23(DAT2B0)
NetJ2_2: J2.2(DATA3) U19.22(DAT3B0)
NetJ2_3: J2.3(CMD) R39.2 U19.20(CMDB0)
NetJ2_5: J2.5(CLK) U19.19(CLKB0)
NetJ2_7: J2.7(DATA0) U19.18(DAT0B0)
NetJ2_8: J2.8(DATA1) U19.16(DAT1B0)
NetJ2_9: J2.9(CD) R125.2
NetR123_1: R123.1 U19.24(SEL)

Not connected (* = marked no-connect by the designer): U19 8(DAT2B1) 10(DAT3B1) 12(CMDB1) 13(CLKB1) 14(DAT0B1) 15(DAT1B1) 17(VCCB1)

### Buses and harness runs
bus SDIO_D[0..3]

### Layout directives
net class SD: SDIO_CD, SDIO_CLK, SDIO_CMD, SDIO_D[0..3]

### Notes on the sheet
- SD Card

### Library data of the parts
C95 C193 C194 = Cap: Capacitor; Published: 8-Jun-2000; LatestRevisionDate: 17-Jul-2002; LatestRevisionNote: Re-released for DXP Platform.; PackageReference: RAD-0.3; Publisher: Altium Limited; PackageDescription: Radial Cap, Thru-Hole; 2 Leads; 0.3 in Pin Spacing
R39 R123-R125 = Res1: Resistor; Value: 1K; Published: 8-Jun-2000; LatestRevisionDate: 17-Jul-2002; LatestRevisionNote: Re-released for DXP Platform.; PackageReference: AXIAL-0.3; Publisher: Altium Limited; PackageDescription: Axial Device, Thru-Hole; 2 Leads; 0.3 in Pin Spacing
U19 = TXS02612RTWR: No Description Available; Mfr_Name: Texas Instruments; Copyright: Copyright (C) 2022 Ultra Librarian. All rights reserved.; Manufacturer_Part_Number: TXS02612RTWR; RefDes: RefDes; Type: DEV

## Sheet PWR.SchDoc
size A4
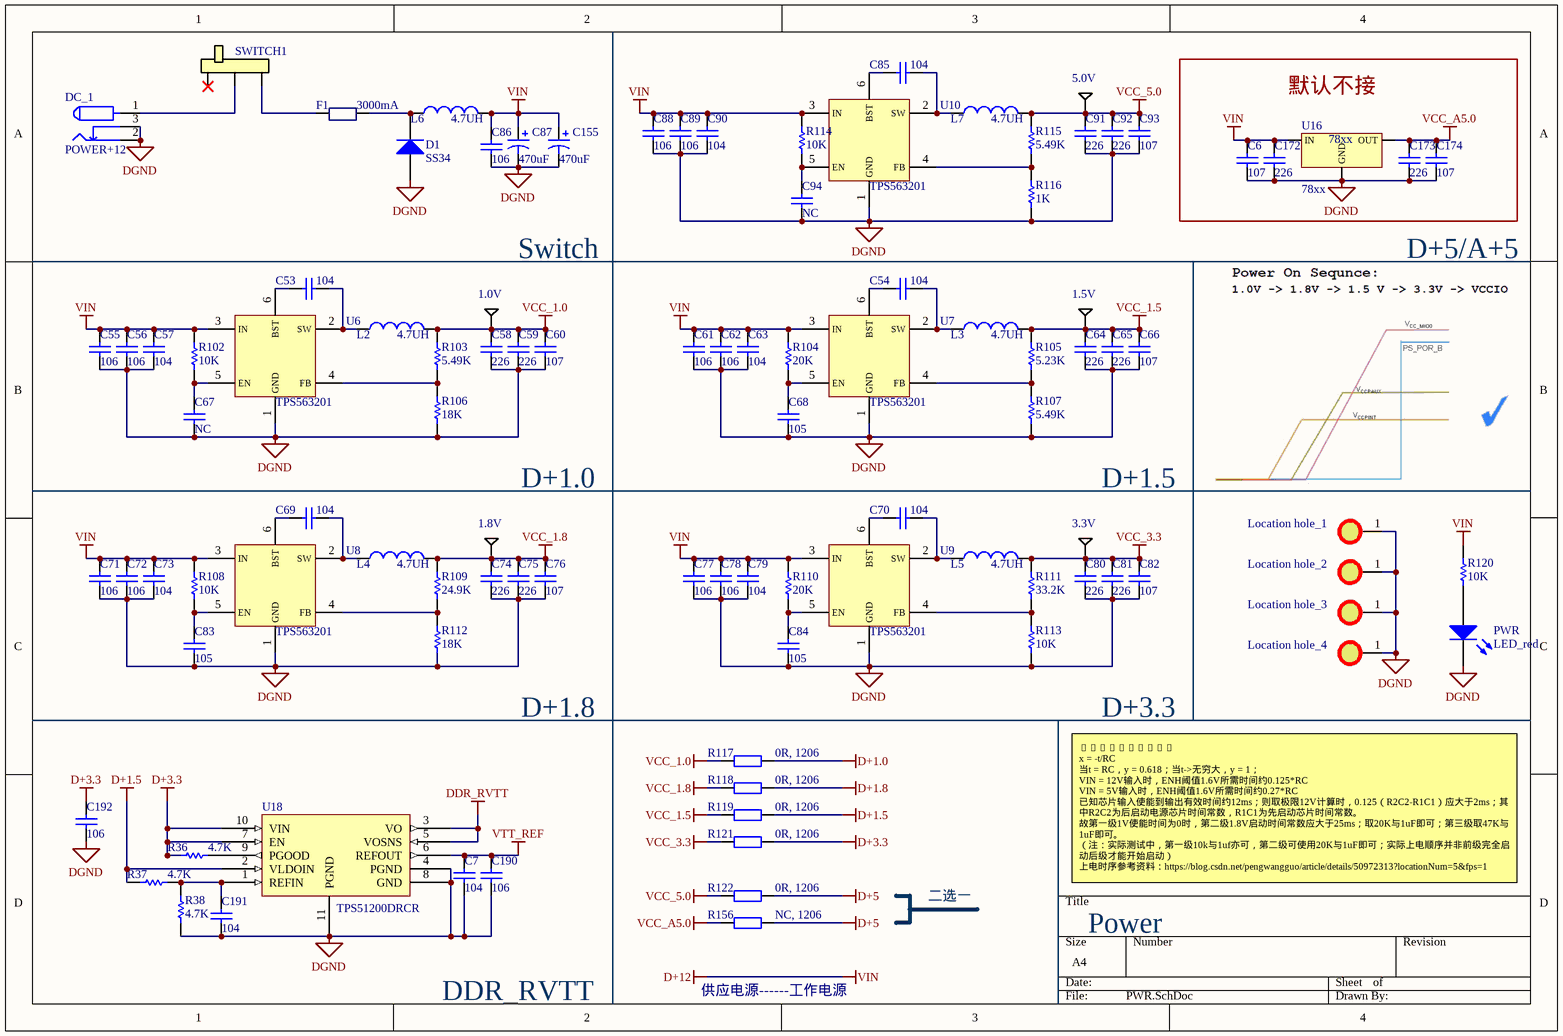
[diagram p12: PWR.SchDoc]

### Parts
1.0V  Test  [Test Point]  (value not drawn)
1.5V  Test  [Test Point]  (value not drawn)
1.8V  Test  [Test Point]  (value not drawn)
3.3V  Test  [Test Point]  (value not drawn)
5.0V  Test  [Test Point]  (value not drawn)
C6  107  [C 1206_L]
C7  104  [C 0402_LL]
C53  104  [C 0402_LL]
C54  104  [C 0402_LL]
C55  106  [C 0805_L]
C56  106  [C 0805_L]
C57  104  [C 0402_LL]
C58  226  [C 0805_L]
C59  226  [C 0805_L]
C60  107  [C 1206_L]
C61  106  [C 0805_L]
C62  106  [C 0805_L]
C63  104  [C 0402_LL]
C64  226  [C 0805_L]
C65  226  [C 0805_L]
C66  107  [C 1206_L]
C67  NC  [C 0402_LL]
C68  105  [C 0402_LL]
C69  104  [C 0402_LL]
C70  104  [C 0402_LL]
C71  106  [C 0805_L]
C72  106  [C 0805_L]
C73  104  [C 0402_LL]
C74  226  [C 0805_L]
C75  226  [C 0805_L]
C76  107  [C 1206_L]
C77  106  [C 0805_L]
C78  106  [C 0805_L]
C79  104  [C 0402_LL]
C80  226  [C 0805_L]
C81  226  [C 0805_L]
C82  107  [C 1206_L]
C83  105  [C 0402_LL]
C84  105  [C 0402_LL]
C85  104  [C 0402_LL]
C86  106  [C 0805_L]
C87  value 470uF  [CD D(7343)]  (hidden comment: Cap Pol1)
C88  106  [C 0805_L]
C89  106  [C 0805_L]
C90  104  [C 0402_LL]
C91  226  [C 0805_L]
C92  226  [C 0805_L]
C93  107  [C 1206_L]
C94  NC  [C 0402_LL]
C155  value 470uF  [CD D(7343)]  (hidden comment: Cap Pol1)
C172  226  [C 0805_L]
C173  226  [C 0805_L]
C174  107  [C 1206_L]
C190  106  [C 0603_L]
C191  104  [C 0402_LL]
C192  106  [C 0603_L]
D1  SS34  [SMA]
DC_1  POWER+12  [DC-005]
F1  3000mA  [FU 1812]
L2  value 4.7UH  [NR6045]  (hidden comment: Inductor)
L3  value 4.7UH  [NR6045]  (hidden comment: Inductor)
L4  value 4.7UH  [NR6045]  (hidden comment: Inductor)
L5  value 4.7UH  [NR6045]  (hidden comment: Inductor)
L6  value 4.7UH  [NR6045]  (hidden comment: Inductor)
L7  value 4.7UH  [NR6045]  (hidden comment: Inductor)
Location_hole_1  Touch  [M3x4+6_N]  (value not drawn)
Location_hole_2  Touch  [M3x4+6_N]  (value not drawn)
Location_hole_3  Touch  [M3x4+6_N]  (value not drawn)
Location_hole_4  Touch  [M3x4+6_N]  (value not drawn)
PWR  LED_red  [LED 0603W]
R36  4.7K  [R 0402_L]
R37  4.7K  [R 0402_L]
R38  4.7K  [R 0402_L]
R102  10K  [R 0603_L]
R103  5.49K  [R 0603_L]
R104  20K  [R 0603_L]
R105  5.23K  [R 0603_L]
R106  18K  [R 0603_L]
R107  5.49K  [R 0603_L]
R108  10K  [R 0603_L]
R109  24.9K  [R 0603_L]
R110  20K  [R 0603_L]
R111  33.2K  [R 0603_L]
R112  18K  [R 0603_L]
R113  10K  [R 0603_L]
R114  10K  [R 0603_L]
R115  5.49K  [R 0603_L]
R116  1K  [R 0603_L]
R117  0R, 1206  [R 1206_L]
R118  0R, 1206  [R 1206_L]
R119  0R, 1206  [R 1206_L]
R120  10K  [R 0603_L]
R121  0R, 1206  [R 1206_L]
R122  0R, 1206  [R 1206_L]
R156  NC, 1206  [R 1206_L]
SWITCH1  Switch  [SS-12D10]  (value not drawn)
U6  TPS563201  [SOT23-6N]
U7  TPS563201  [SOT23-6N]
U8  TPS563201  [SOT23-6N]
U9  TPS563201  [SOT23-6N]
U10  TPS563201  [SOT23-6N]
U16  78xx  [TO252]
U18  TPS51200DRCR  [VSON]

### Blocks framed on the sheet
默认不接: C6 C172-C174 U16

### Nets
D+1.0: R117.2
D+1.5: R37.1 R119.2 U18.2(VLDOIN)
D+1.8: R118.2
D+3.3: C192.2 R36.1 R121.2 U18.7(EN) U18.10(VIN)
D+5: R122.2 R156.2
D+12: C6.1 C55.1 C56.1 C57.1 C61.1 C62.1 C63.1 C71.1 C72.1 C73.1 C77.1 C78.1 C79.1 C86.1 C87.1 C88.1 C89.1 C90.1 C155.1 C172.1 L6.2 R102.2 R104.2 R108.2 R110.2 R114.1 R120.2 U6.3(IN) U7.3(IN) U8.3(IN) U9.3(IN) U10.3(IN) U16.1(IN)  [also labelled VIN]
DDR_RVTT: U18.3(VO) U18.5(VOSNS)
DGND: C6.2 C7.1 C55.2 C56.2 C57.2 C58.2 C59.2 C60.2 C61.2 C62.2 C63.2 C64.2 C65.2 C66.2 C67.2 C68.2 C71.2 C72.2 C73.2 C74.2 C75.2 C76.2 C77.2 C78.2 C79.2 C80.2 C81.2 C82.2 C83.2 C84.2 C86.2 C87.2 C88.2 C89.2 C90.2 C91.2 C92.2 C93.2 C94.2 C155.2 C172.2 C173.2 C174.2 C190.1 C191.1 C192.1 D1.1(A) DC_1.2 DC_1.3 Location_hole_1.1 Location_hole_2.1 Location_hole_3.1 Location_hole_4.1 PWR.2(K) R38.1 R106.1 R107.1 R112.1 R113.1 R116.1 U6.1(GND) U7.1(GND) U8.1(GND) U9.1(GND) U10.1(GND) U16.2(GND) U18.4(PGND) U18.8(GND) U18.11(PGND)
VCC_1.0: 1.0V.1(Test) C58.1 C59.1 C60.1 L2.2 R103.2 R117.1
VCC_1.5: 1.5V.1(Test) C64.1 C65.1 C66.1 L3.2 R105.2 R119.1
VCC_1.8: 1.8V.1(Test) C74.1 C75.1 C76.1 L4.2 R109.2 R118.1
VCC_3.3: 3.3V.1(Test) C80.1 C81.1 C82.1 L5.2 R111.2 R121.1
VCC_5.0: 5.0V.1(Test) C91.1 C92.1 C93.1 L7.2 R115.2 R122.1
VCC_A5.0: C173.1 C174.1 R156.1 U16.3(OUT)
VTT_REF: C7.2 C190.2 U18.6(REFOUT)
NetC53_1: C53.1 L2.1 U6.2(SW)
NetC53_2: C53.2 U6.6(BST)
NetC54_1: C54.1 L3.1 U7.2(SW)
NetC54_2: C54.2 U7.6(BST)
NetC67_1: C67.1 R102.1 U6.5(EN)
NetC68_1: C68.1 R104.1 U7.5(EN)
NetC69_1: C69.1 L4.1 U8.2(SW)
NetC69_2: C69.2 U8.6(BST)
NetC70_1: C70.1 L5.1 U9.2(SW)
NetC70_2: C70.2 U9.6(BST)
NetC83_1: C83.1 R108.1 U8.5(EN)
NetC84_1: C84.1 R110.1 U9.5(EN)
NetC85_1: C85.1 L7.1 U10.2(SW)
NetC85_2: C85.2 U10.6(BST)
NetC94_1: C94.1 R114.2 U10.5(EN)
NetC191_2: C191.2 R37.2 R38.2 U18.1(REFIN)
NetD1_2: D1.2(K) F1.1 L6.1
NetDC_1_1: DC_1.1 SWITCH1.2
NetF1_2: F1.2 SWITCH1.3
NetPWR_1: PWR.1(A) R120.1
NetR36_2: R36.2 U18.9(PGOOD)
NetR103_1: R103.1 R106.2 U6.4(FB)
NetR105_1: R105.1 R107.2 U7.4(FB)
NetR109_1: R109.1 R112.2 U8.4(FB)
NetR111_1: R111.1 R113.2 U9.4(FB)
NetR115_1: R115.1 R116.2 U10.4(FB)

Not connected (* = marked no-connect by the designer): SWITCH1 1*

### Notes on the sheet
- Switch
- D+5/A+5
- D+1.0
- D+1.5
- D+1.8
- D+3.3
- Vref = 0.768V
  1.0V : (R1+Rf)/Rf = 1.309(5.49K; 18K)
  1.5V : (R1+Rf)/Rf = 1.953(5.23K; 5.49K)
  1.8V : (R1+Rf)/Rf = 2.37(24.9K; 18K)
  3.3V : (R1+Rf)/Rf = 4.32(33.2K; 10K)
- 二选一
- 𝑦=1−𝑒^(−𝑥)
  x = -t/RC
  当t = RC，y = 0.618；当t->无穷大，y = 1；
  VIN = 12V输入时，ENH阈值1.6V所需时间约0.125*RC
  VIN = 5V输入时，ENH阈值1.6V所需时间约0.27*RC
  已知芯片输入使能到输出有效时间约12ms；则取极限12V计算时，0.125（R2C2-R1C1）应大于2ms；其中R2C2为后启动电源芯片时间常数，R1C1为先启动芯片时间常数。
  故第一级1V使能时间为0时，第二级1.8V启动时间常数应大于25ms；取20K与1uF即可；第三级取47K与1uF即可。
  （注：实际测试中，第一级10k与1uf亦可，第二级可使用20K与1uF即可；实际上电顺序并非前级完全启动后级才能开始启动）
  上电时序参考资料：https://blog.csdn.net/pengwangguo/article/details/50972313?locationNum=5&fps=1
- Power
- DDR_RVTT
- 供应电源------工作电源

### Library data of the parts
1.0V 1.5V 1.8V 3.3V 5.0V = Test: Test Point
C6 C7 C53-C86 C88-C94 C172-C174 C190-C192 = Cap: Capacitor; Published: 8-Jun-2000; LatestRevisionDate: 17-Jul-2002; LatestRevisionNote: Re-released for DXP Platform.; PackageReference: RAD-0.3; Publisher: Altium Limited; PackageDescription: Radial Cap, Thru-Hole; 2 Leads; 0.3 in Pin Spacing
C87 C155 = Cap Pol1: Polarized Capacitor (Radial); Published: 8-Jun-2000; LatestRevisionDate: 17-Jul-2002; LatestRevisionNote: Re-released for DXP Platform.; PackageReference: RB7.6-15; Publisher: Altium Limited; PackageDescription: Polarized Capacitor (Radial); 2 Leads
D1 = Diode: Default Diode; Published: 8-Jun-2000; LatestRevisionDate: 17-Jul-2002; LatestRevisionNote: Re-released for DXP Platform.; PackageVersion: Sep-1996; PackageReference: SMC; Publisher: Altium Limited; PackageDescription: DO-214-AB/SMC; 2 C-Bend Leads; Body 7.9 x 5.9 mm, inc. leads (LxW); Code_JEDEC: DO-214-AB
DC_1 = POWER
F1 = PTC
L2-L7 = Inductor: Code_IEC: 1005; Published: 8-Jun-2000; LatestRevisionDate: 29-May-2009; LatestRevisionNote: IPC-7351 Footprint Added.; PackageReference: 0402-A; Publisher: Altium Limited; PackageDescription: Chip Inductor; Code_JEITA: 0402
PWR = LED0: Typical INFRARED GaAs LED; Published: 8-Jun-2000; LatestRevisionDate: 08-Jul-2005; LatestRevisionNote: Mech Layer 1 removed.; PackageReference: LED-0; Publisher: Altium Limited; PackageDescription: LED; 2 Leads
R36-R38 R102-R115 R120 = Res1: Resistor; Value: 1K; Published: 8-Jun-2000; LatestRevisionDate: 17-Jul-2002; LatestRevisionNote: Re-released for DXP Platform.; PackageReference: AXIAL-0.3; Publisher: Altium Limited; PackageDescription: Axial Device, Thru-Hole; 2 Leads; 0.3 in Pin Spacing
R116 = Res1: Resistor; Published: 8-Jun-2000; LatestRevisionDate: 17-Jul-2002; LatestRevisionNote: Re-released for DXP Platform.; PackageReference: AXIAL-0.3; Publisher: Altium Limited; PackageDescription: Axial Device, Thru-Hole; 2 Leads; 0.3 in Pin Spacing; Value: 1K
R117-R119 R121 R122 R156 = Res2: Resistor; Value: RES; Published: 8-Jun-2000; LatestRevisionDate: 17-Jul-2002; LatestRevisionNote: Re-released for DXP Platform.; PackageReference: AXIAL-0.4; Publisher: Altium Limited; PackageDescription: Axial Device, Thru-Hole; 2 Leads; 0.4 in Pin Spacing
U6-U10 = TPS563201: TPS563201, BUCK, 3A
U18 = TPS51200: DDR 终端稳压器; Manufacturer: TI; value: NC

## Sheet Ethernet.SchDoc
size A4
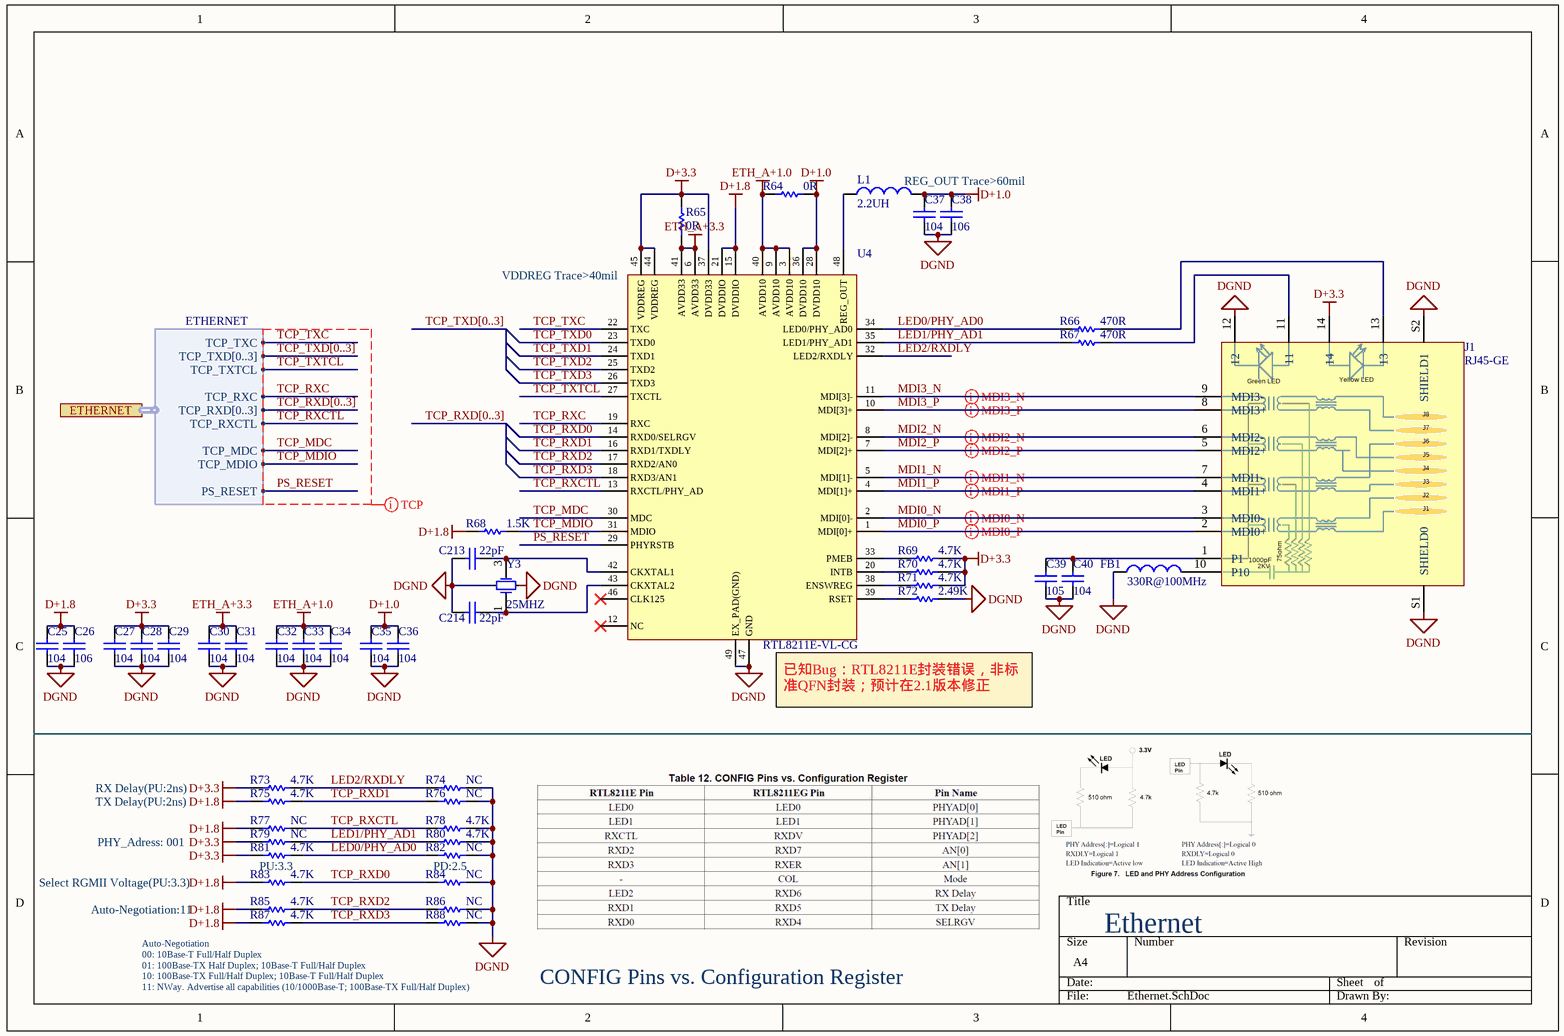
[diagram p13: Ethernet.SchDoc]

### Parts
C25  104  [C 0402_LL]
C26  106  [C 0603_L]
C27  104  [C 0402_LL]
C28  104  [C 0402_LL]
C29  104  [C 0402_LL]
C30  104  [C 0402_LL]
C31  104  [C 0402_LL]
C32  104  [C 0402_LL]
C33  104  [C 0402_LL]
C34  104  [C 0402_LL]
C35  104  [C 0402_LL]
C36  104  [C 0402_LL]
C37  104  [C 0402_LL]
C38  106  [C 0603_L]
C39  105  [C 0603_L]
C40  104  [C 0402_LL]
C213  22pF  [C 0603_L]
C214  22pF  [C 0603_L]
FB1  value 330R@100MHz  [L 0805]  (hidden comment: Ferrite Bead)
J1  RJ45-GE  [RJ45_10]
L1  value 2.2UH  [NR3010]  (hidden comment: Inductor)
R64  0R  [R 0603_L]
R65  0R  [R 0603_L]
R66  470R  [R 0603_L]
R67  470R  [R 0603_L]
R68  1.5K  [R 0603_L]
R69  4.7K  [R 0402_L]
R70  4.7K  [R 0402_L]
R71  4.7K  [R 0402_L]
R72  2.49K  [R 0603_L]
R73  4.7K  [R 0402_L]
R74  NC  [R 0402_L]
R75  4.7K  [R 0402_L]
R76  NC  [R 0402_L]
R77  NC  [R 0402_L]
R78  4.7K  [R 0402_L]
R79  NC  [R 0402_L]
R80  4.7K  [R 0402_L]
R81  4.7K  [R 0402_L]
R82  NC  [R 0402_L]
R83  4.7K  [R 0402_L]
R84  NC  [R 0402_L]
R85  4.7K  [R 0402_L]
R86  NC  [R 0402_L]
R87  4.7K  [R 0402_L]
R88  NC  [R 0402_L]
U4  RTL8211E-VL-CG  [QFN48_RTL8211]
Y3  25MHZ  [OSC 5032-4P]

### Ports
ETHERNET (harness ETHERNET)

### Harnesses
ETHERNET: TCP_TXC, TCP_TXD[0..3], TCP_TXTCL, TCP_RXC, TCP_RXD[0..3], TCP_RXCTL, TCP_MDC, TCP_MDIO, PS_RESET

### Nets
D+1.0: C35.1 C36.1 C37.1 C38.1 L1.2 R64.2 U4.28(DVDD10) U4.36(DVDD10)
D+1.8: C25.1 C26.1 R68.2 R75.2 R77.2 R83.2 R85.2 R87.2 U4.15(DVDDIO) U4.21(DVDDIO)
D+3.3: C27.1 C28.1 C29.1 J1.14 R65.2 R69.1 R70.1 R71.1 R73.2 R79.2 R81.2 U4.37(DVDD33) U4.44(VDDREG) U4.45(VDDREG)
DGND: C25.2 C26.2 C27.2 C28.2 C29.2 C30.2 C31.2 C32.2 C33.2 C34.2 C35.2 C36.2 C37.2 C38.2 C39.2 C40.2 C213.1 C214.1 FB1.1 J1.12 J1.S1(SHIELD0) J1.S2(SHIELD1) R72.1 R74.1 R76.1 R78.1 R80.1 R82.1 R84.1 R86.1 R88.1 U4.47(GND) U4.49(EX_PAD(GND)) Y3.2 Y3.4
ETH_A+1.0: C32.1 C33.1 C34.1 R64.1 U4.3(AVDD10) U4.9(AVDD10) U4.40(AVDD10)
ETH_A+3.3: C30.1 C31.1 R65.1 U4.6(AVDD33) U4.41(AVDD33)
LED0/PHY_AD0: R66.1 R81.1 R82.2 U4.34(LED0/PHY_AD0)
LED1/PHY_AD1: R67.1 R79.1 R80.2 U4.35(LED1/PHY_AD1)
LED2/RXDLY: R73.1 R74.2 U4.32(LED2/RXDLY)
MDI0_N: J1.3(MDI0-) U4.2(MDI[0]-)
MDI0_P: J1.2(MDI0+) U4.1(MDI[0]+)
MDI1_N: J1.7(MDI1-) U4.5(MDI[1]-)
MDI1_P: J1.4(MDI1+) U4.4(MDI[1]+)
MDI2_N: J1.6(MDI2-) U4.8(MDI[2]-)
MDI2_P: J1.5(MDI2+) U4.7(MDI[2]+)
MDI3_N: J1.9(MDI3-) U4.11(MDI[3]-)
MDI3_P: J1.8(MDI3+) U4.10(MDI[3]+)
PS_RESET: U4.29(PHYRSTB) ; port ETHERNET.PS_RESET
TCP_MDC: U4.30(MDC) ; port ETHERNET.TCP_MDC
TCP_MDIO: R68.1 U4.31(MDIO) ; port ETHERNET.TCP_MDIO
TCP_RXC: U4.19(RXC) ; port ETHERNET.TCP_RXC
TCP_RXCTL: R77.1 R78.2 U4.13(RXCTL/PHY_AD) ; port ETHERNET.TCP_RXCTL
TCP_RXD0: R83.1 R84.2 U4.14(RXD0/SELRGV)
TCP_RXD1: R75.1 R76.2 U4.16(RXD1/TXDLY)
TCP_RXD2: R85.1 R86.2 U4.17(RXD2/AN0)
TCP_RXD3: R87.1 R88.2 U4.18(RXD3/AN1)
TCP_TXC: U4.22(TXC) ; port ETHERNET.TCP_TXC
TCP_TXD0: U4.23(TXD0)
TCP_TXD1: U4.24(TXD1)
TCP_TXD2: U4.25(TXD2)
TCP_TXD3: U4.26(TXD3)
TCP_TXTCL: U4.27(TXCTL) ; port ETHERNET.TCP_TXTCL
NetC39_1: C39.1 C40.1 J1.1(P1)
NetC213_2: C213.2 U4.42(CKXTAL1) Y3.3(OSC2)
NetC214_2: C214.2 U4.43(CKXTAL2) Y3.1(OSC1)
NetFB1_2: FB1.2 J1.10(P10)
NetJ1_11: J1.11 R67.2
NetJ1_13: J1.13 R66.2
NetL1_1: L1.1 U4.48(REG_OUT)
NetR69_2: R69.2 U4.33(PMEB)
NetR70_2: R70.2 U4.20(INTB)
NetR71_2: R71.2 U4.38(ENSWREG)
NetR72_2: R72.2 U4.39(RSET)

Not connected (* = marked no-connect by the designer): U4 12(NC)* 46(CLK125)*

### Buses and harness runs
bus TCP_RXD[0..3]
bus TCP_TXD[0..3]

### Layout directives
differential pair; differential pair class MDI3: MDI3_N, MDI3_P
differential pair; differential pair class MDI2: MDI2_N, MDI2_P
differential pair; differential pair class MDI1: MDI1_N, MDI1_P
differential pair; differential pair class MDI0: MDI0_N, MDI0_P
net class TCP: PS_RESET, TCP_MDC, TCP_MDIO, TCP_RXC, TCP_RXCTL, TCP_RXD[0..3], TCP_TXC, TCP_TXD[0..3], TCP_TXTCL

### Notes on the sheet
- (near L1) REG_OUT Trace>60mil
- (near U4) VDDREG Trace>40mil
- (near U4) 已知Bug：RTL8211E封装错误，非标准QFN封装；预计在2.1版本修正
- RX Delay(PU:2ns)
- PHY_Adress: 001
- TX Delay(PU:2ns)
- Select RGMII Voltage(PU:3.3)
- Auto-Negotiation:11
- PU:3.3
- PD:2.5
- Ethernet
- Auto-Negotiation
  00: 10Base-T Full/Half Duplex
  01: 100Base-TX Half Duplex; 10Base-T Full/Half Duplex
  10: 100Base-TX Full/Half Duplex; 10Base-T Full/Half Duplex
  11: NWay. Advertise all capabilities (10/1000Base-T; 100Base-TX Full/Half Duplex)
- CONFIG Pins vs. Configuration Register
- (in symbol RJ45-GE_re) Green LED; Yellow LED; J8; J7; J6; J5; J4; J3; J2; 1000pF; 75ohm; 2KV

### Library data of the parts
C25-C40 C213 C214 = Cap: Capacitor; Published: 8-Jun-2000; LatestRevisionDate: 17-Jul-2002; LatestRevisionNote: Re-released for DXP Platform.; PackageReference: RAD-0.3; Publisher: Altium Limited; PackageDescription: Radial Cap, Thru-Hole; 2 Leads; 0.3 in Pin Spacing
FB1 L1 = Inductor: Code_IEC: 1005; Published: 8-Jun-2000; LatestRevisionDate: 29-May-2009; LatestRevisionNote: IPC-7351 Footprint Added.; PackageReference: 0402-A; Publisher: Altium Limited; PackageDescription: Chip Inductor; Code_JEITA: 0402
J1 = RJ45-GE_re: 千兆以太网接口（带变压器）
R64-R88 = Res1: Resistor; Value: 1K; Published: 8-Jun-2000; LatestRevisionDate: 17-Jul-2002; LatestRevisionNote: Re-released for DXP Platform.; PackageReference: AXIAL-0.3; Publisher: Altium Limited; PackageDescription: Axial Device, Thru-Hole; 2 Leads; 0.3 in Pin Spacing
U4 = RTL8211E: Ethernet PHY / QFN48(E-VB; E-VL; EG-VB)
Y3 = XTAL-4-N: 无源晶振; Manufacturer: NC; value: 25MHZ

## Sheet USB.SchDoc
size A4
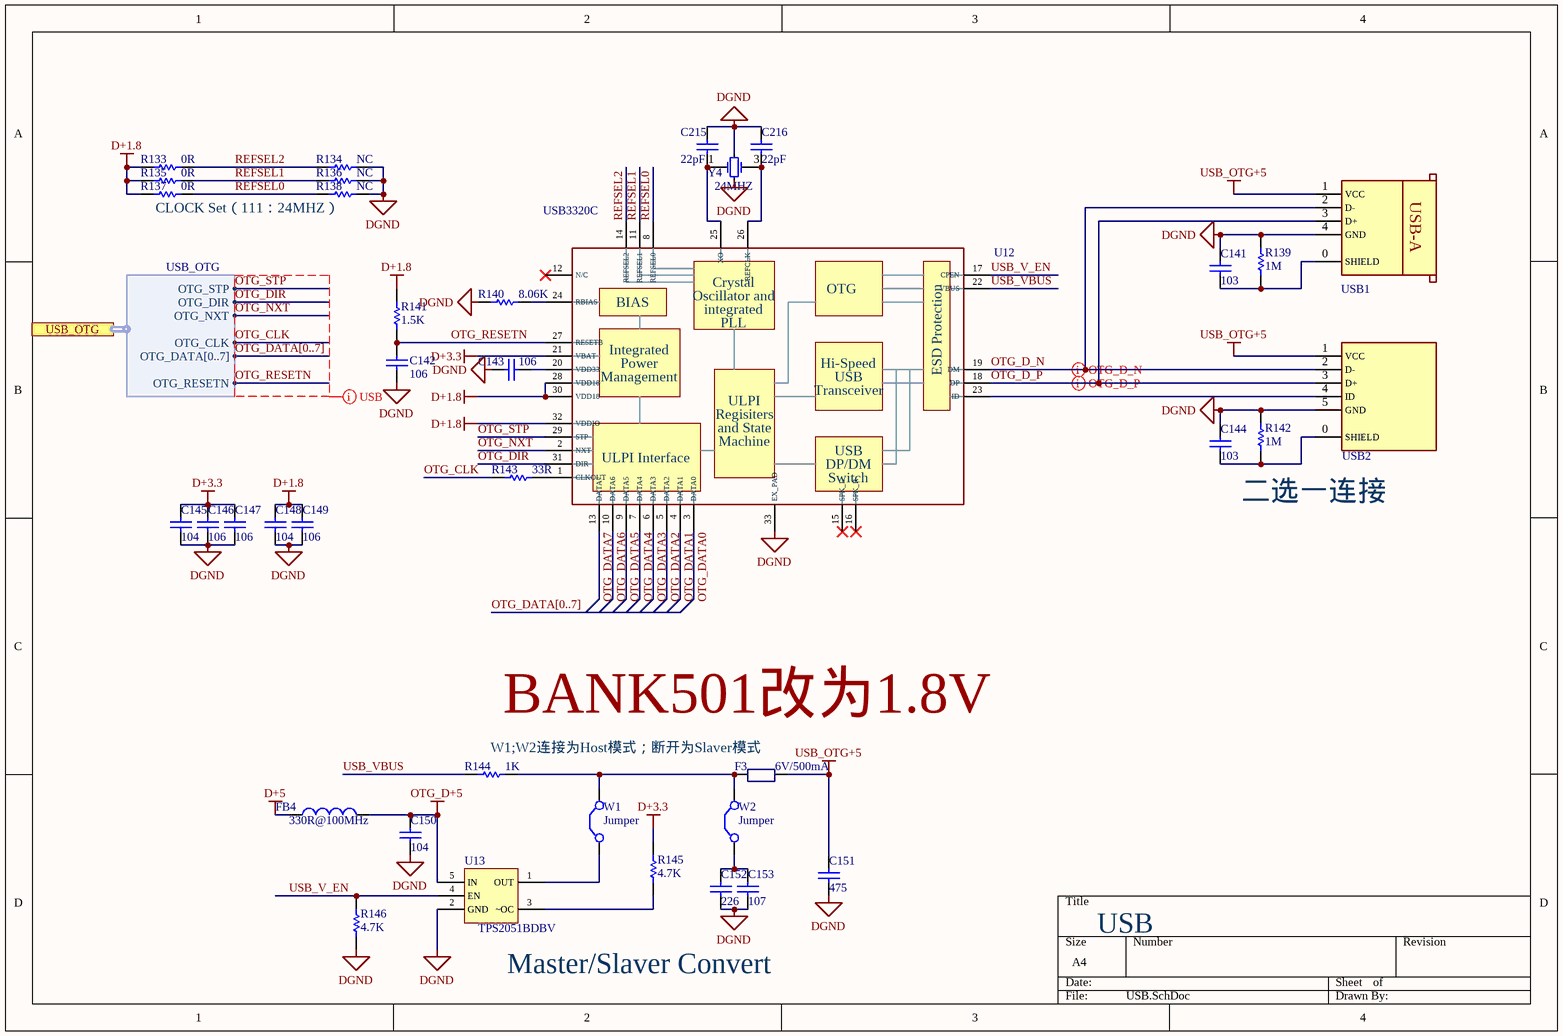
[diagram p14: USB.SchDoc]

### Parts
C141  103  [C 0603_L]
C142  106  [C 0603_L]
C143  106  [C 0603_L]
C144  103  [C 0603_L]
C145  104  [C 0402_LL]
C146  106  [C 0603_L]
C147  106  [C 0603_L]
C148  104  [C 0402_LL]
C149  106  [C 0603_L]
C150  104  [C 0402_LL]
C151  475  [C 0805_L]
C152  226  [C 0805_L]
C153  107  [C 1206_L]
C215  22pF  [C 0603_L]
C216  22pF  [C 0603_L]
F3  6V/500mA  [FU 0805]
FB4  value 330R@100MHz  [L 0805]  (hidden comment: Ferrite Bead)
R133  0R  [R 0402_L]
R134  NC  [R 0402_L]
R135  0R  [R 0402_L]
R136  NC  [R 0402_L]
R137  0R  [R 0402_L]
R138  NC  [R 0402_L]
R139  1M  [R 0603_L]
R140  8.06K  [R 0603_L]
R141  1.5K  [R 0603_L]
R142  1M  [R 0603_L]
R143  33R  [R 0603_L]
R144  1K  [R 0603_L]
R145  4.7K  [R 0603_L]
R146  4.7K  [R 0603_L]
U12  USB3320C  [QFN32 5x5_M]
U13  TPS2051BDBV  [SOT23-5N]
USB1  USB_A,B/S  [USB-A/S_A]  (value not drawn)
USB2  USB_miniB,microB  [USB-MINI-A]  (value not drawn)
W1  Jumper  [HDR2.54-LI-2P]
W2  Jumper  [HDR2.54-LI-2P]
Y4  24MHZ  [OSC 5032-4P]

### Ports
USB_OTG (harness USB_OTG)

### Harnesses
USB_OTG: OTG_STP, OTG_DIR, OTG_NXT, OTG_CLK, OTG_DATA[0..7], OTG_RESETN

### Nets
D+1.8: C148.1 C149.1 R133.2 R135.2 R137.2 R141.2 U12.28(VDD18) U12.30(VDD18) U12.32(VDDIO)
D+3.3: C145.1 C146.1 C147.1 R145.2 U12.21(VBAT)
D+5: FB4.1
DGND: C141.1 C142.2 C143.2 C144.1 C145.2 C146.2 C147.2 C148.2 C149.2 C150.2 C151.2 C152.2 C153.2 C215.1 C216.1 R134.1 R136.1 R138.1 R139.2 R140.1 R142.2 R146.1 U12.33(EX_PAD) U13.2(GND) USB1.4(GND) USB2.5(GND) Y4.2 Y4.4
OTG_D+5: C150.1 FB4.2 U13.5(IN)
USB_OTG+5: C151.1 F3.1 USB1.1(VCC) USB2.1(VCC)
OTG_CLK: R143.1 ; port USB_OTG.OTG_CLK
OTG_D_N: U12.19(DM) USB1.2(D-) USB2.2(D-)
OTG_D_P: U12.18(DP) USB1.3(D+) USB2.3(D+)
OTG_DATA0: U12.3(DATA0)
OTG_DATA1: U12.4(DATA1)
OTG_DATA2: U12.5(DATA2)
OTG_DATA3: U12.6(DATA3)
OTG_DATA4: U12.7(DATA4)
OTG_DATA5: U12.9(DATA5)
OTG_DATA6: U12.10(DATA6)
OTG_DATA7: U12.13(DATA7)
OTG_DIR: U12.31(DIR) ; port USB_OTG.OTG_DIR
OTG_NXT: U12.2(NXT) ; port USB_OTG.OTG_NXT
OTG_RESETN: C142.1 R141.1 U12.27(RESETB) ; port USB_OTG.OTG_RESETN
OTG_STP: U12.29(STP) ; port USB_OTG.OTG_STP
REFSEL0: R137.1 R138.2 U12.8(REFSEL0)
REFSEL1: R135.1 R136.2 U12.11(REFSEL1)
REFSEL2: R133.1 R134.2 U12.14(REFSEL2)
USB_V_EN: R146.2 U12.17(CPEN) U13.4(EN)
USB_VBUS: R144.2 U12.22(VBUS)
NetC141_2: C141.2 R139.1 USB1.0(SHIELD)
NetC143_1: C143.1 U12.20(VDD33)
NetC144_2: C144.2 R142.1 USB2.0(SHIELD)
NetC152_1: C152.1 C153.1 W2.1(C1)
NetC215_2: C215.2 U12.25(XO) Y4.1(OSC1)
NetC216_2: C216.2 U12.26(REFCLK) Y4.3(OSC2)
NetF3_2: F3.2 R144.1 W1.2(C2) W2.2(C2)
NetR140_2: R140.2 U12.24(RBIAS)
NetR143_2: R143.2 U12.1(CLKOUT)
NetR145_1: R145.1 U13.3(~OC)
NetU12_23: U12.23(ID) USB2.4(ID)
NetU13_1: U13.1(OUT) W1.1(C1)

Not connected (* = marked no-connect by the designer): U12 12(N/C)* 15(SPK_L)* 16(SPK_R)*

### Buses and harness runs
bus OTG_DATA[0..7]

### Layout directives
differential pair; differential pair class OTG_DATA: OTG_D_N, OTG_D_P
net class USB: OTG_CLK, OTG_DATA[0..7], OTG_DIR, OTG_NXT, OTG_RESETN, OTG_STP

### Notes on the sheet
- CLOCK Set（111：24MHZ）
- 二选一连接
- BANK501改为1.8V
- W1;W2连接为Host模式；断开为Slaver模式
- USB
- Master/Slaver Convert
- (in symbol USB3320C_re) Crystal; OTG; Oscillator and; BIAS; integrated; PLL; ESD Protection; Integrated; Power; Hi-Speed; Management; USB; Transceiver; ULPI; Regisiters; and State; Machine; ULPI Interface; DP/DM; Switch
- (in symbol USB_A,B/S) USB-A

### Library data of the parts
C141-C153 C215 C216 = Cap: Capacitor; Published: 8-Jun-2000; LatestRevisionDate: 17-Jul-2002; LatestRevisionNote: Re-released for DXP Platform.; PackageReference: RAD-0.3; Publisher: Altium Limited; PackageDescription: Radial Cap, Thru-Hole; 2 Leads; 0.3 in Pin Spacing
F3 = PTC
FB4 = Inductor: Code_IEC: 1005; Published: 8-Jun-2000; LatestRevisionDate: 29-May-2009; LatestRevisionNote: IPC-7351 Footprint Added.; PackageReference: 0402-A; Publisher: Altium Limited; PackageDescription: Chip Inductor; Code_JEITA: 0402
R133-R143 R145 R146 = Res1: Resistor; Value: 1K; Published: 8-Jun-2000; LatestRevisionDate: 17-Jul-2002; LatestRevisionNote: Re-released for DXP Platform.; PackageReference: AXIAL-0.3; Publisher: Altium Limited; PackageDescription: Axial Device, Thru-Hole; 2 Leads; 0.3 in Pin Spacing
R144 = Res1: Resistor; Published: 8-Jun-2000; LatestRevisionDate: 17-Jul-2002; LatestRevisionNote: Re-released for DXP Platform.; PackageReference: AXIAL-0.3; Publisher: Altium Limited; PackageDescription: Axial Device, Thru-Hole; 2 Leads; 0.3 in Pin Spacing; Value: 1K
U12 = USB3320C_re: USB PHY
U13 = TPS2051BDBV: Current-Limited, Power-Distribution Switches
W1 W2 = Jumper: Jumper Wire; Published: 24-Mar-1999; LatestRevisionDate: 17-Jul-2002; LatestRevisionNote: Re-released for DXP Platform.; PackageReference: RAD-0.2; Publisher: Altium Limited; PackageDescription: Radial Cap, Thru-Hole; 2 Leads; 0.2 in Pin Spacing
Y4 = XTAL-4-N: 无源晶振; Manufacturer: NC; value: 25MHZ

## Sheet USB_JTAG.SchDoc
size A3
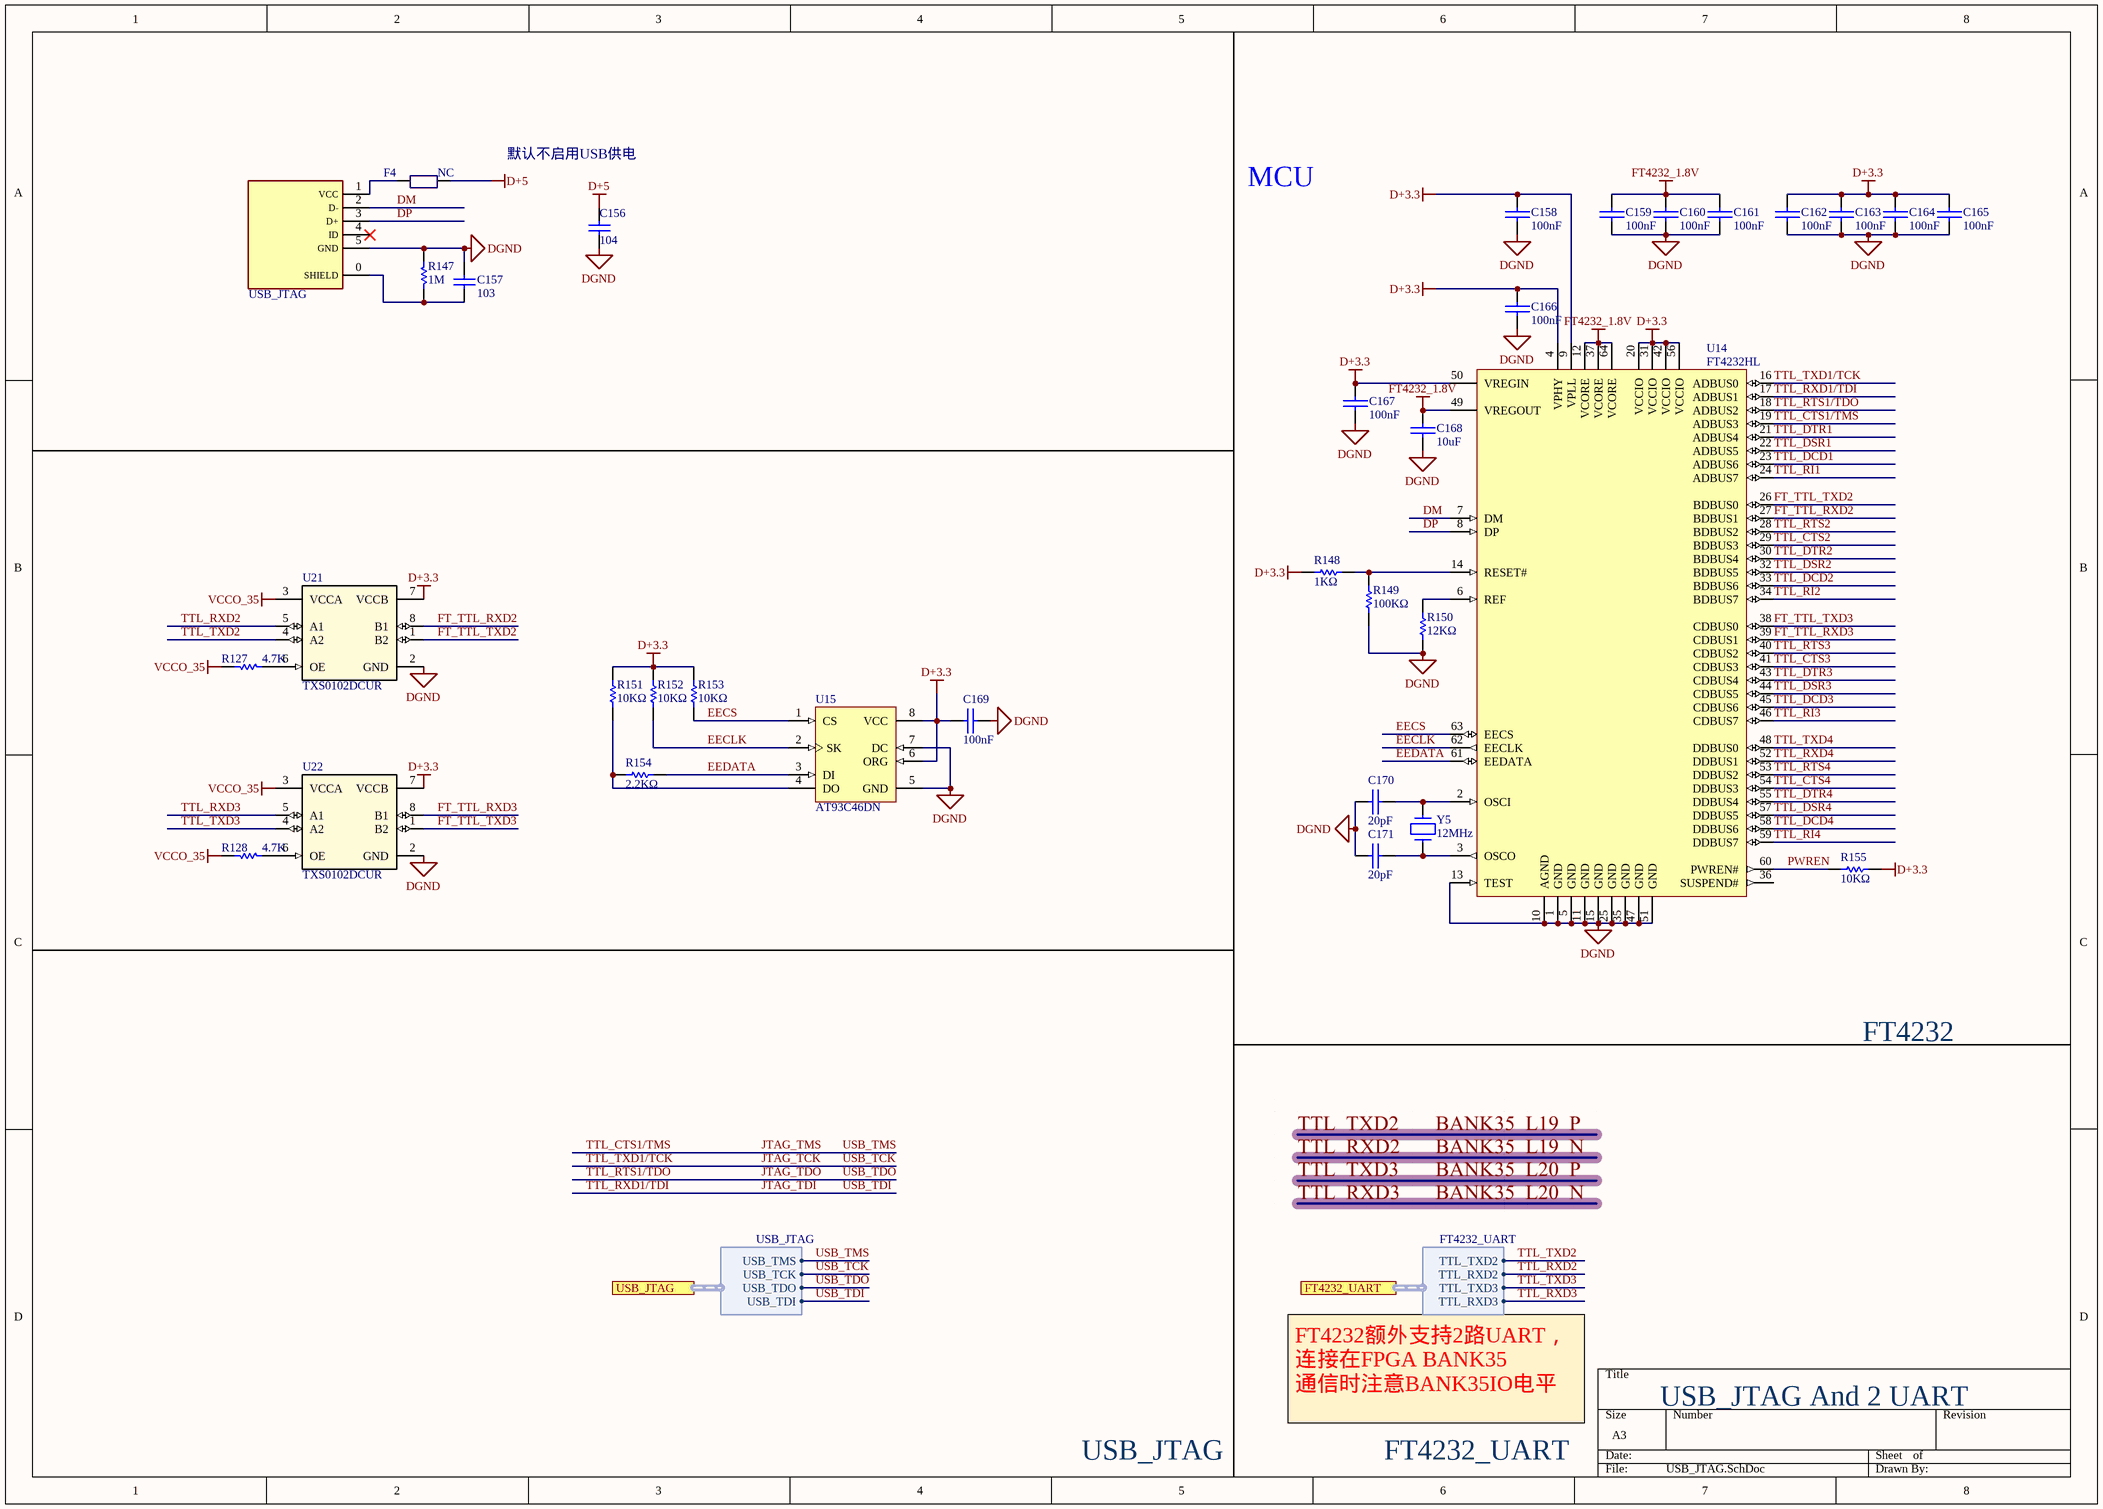
[diagram p15: USB_JTAG.SchDoc]

### Parts
C156  104  [C 0402_LL]
C157  103  [C 0603_L]
C158  100nF  [C 0402_L]
C159  100nF  [C 0402_L]
C160  100nF  [C 0402_L]
C161  100nF  [C 0402_L]
C162  100nF  [C 0402_L]
C163  100nF  [C 0402_L]
C164  100nF  [C 0402_L]
C165  100nF  [C 0402_L]
C166  100nF  [C 0402_L]
C167  100nF  [C 0402_L]
C168  10uF  [C 0603_L]
C169  100nF  [C 0402_L]
C170  20pF  [C 0603_L]
C171  20pF  [C 0603_L]
F4  NC  [FU 0805]
R127  4.7K  [R 0603_L]
R128  4.7K  [R 0603_L]
R147  1M  [R 0603_L]
R148  1KΩ  [R 0603_L]
R149  100KΩ  [R 0603_L]
R150  12KΩ  [R 0603_L]
R151  10KΩ  [R 0603_L]
R152  10KΩ  [R 0603_L]
R153  10KΩ  [R 0603_L]
R154  2.2KΩ  [R 0603_L]
R155  10KΩ  [R 0603_L]
U14  FT4232HL  [LQFP64 10x10_L]
U15  AT93C46DN  [SOP8_L]
U21  TXS0102DCUR  [DCU0008A_N]
U22  TXS0102DCUR  [DCU0008A_N]
USB_JTAG  USB_miniB,microB  [USB-MINI-A]  (value not drawn)
Y5  12MHz  [OSC 5032-2P]

### Ports
FT4232_UART (harness FT4232_UART), USB_JTAG (harness USB_JTAG)

### Harnesses
USB_JTAG: USB_TMS, USB_TCK, USB_TDI, USB_TDO
FT4232_UART: TTL_TXD2, TTL_RXD2, TTL_RXD3, TTL_TXD3

### Nets
D+3.3: C158.2 C162.2 C163.2 C164.2 C165.2 C166.2 C167.2 C169.2 R148.1 R151.2 R152.2 R153.2 R155.2 U14.4(VPHY) U14.9(VPLL) U14.20(VCCIO) U14.31(VCCIO) U14.42(VCCIO) U14.50(VREGIN) U14.56(VCCIO) U15.6(ORG) U15.8(VCC) U21.7(VCCB) U22.7(VCCB)
D+5: C156.2 F4.1
DGND: C156.1 C157.1 C158.1 C159.1 C160.1 C161.1 C162.1 C163.1 C164.1 C165.1 C166.1 C167.1 C168.1 C169.1 C170.1 C171.1 R147.2 R149.1 R150.1 U14.1(GND) U14.5(GND) U14.10(AGND) U14.11(GND) U14.13(TEST) U14.15(GND) U14.25(GND) U14.35(GND) U14.47(GND) U14.51(GND) U15.5(GND) U15.7(DC) U21.2(GND) U22.2(GND) USB_JTAG.5(GND)
FT4232_1.8V: C159.2 C160.2 C161.2 C168.2 U14.12(VCORE) U14.37(VCORE) U14.49(VREGOUT) U14.64(VCORE)
VCCO_35: R127.2 R128.2 U21.3(VCCA) U22.3(VCCA)
DM: U14.7(DM) USB_JTAG.2(D-)
DP: U14.8(DP) USB_JTAG.3(D+)
EECLK: R152.1 U14.62(EECLK) U15.2(SK)
EECS: R153.1 U14.63(EECS) U15.1(CS)
EEDATA: R154.2 U14.61(EEDATA) U15.3(DI)
FT_TTL_RXD2: U14.27(BDBUS1) U21.8(B1)
FT_TTL_RXD3: U14.39(CDBUS1) U22.8(B1)
FT_TTL_TXD2: U14.26(BDBUS0) U21.1(B2)
FT_TTL_TXD3: U14.38(CDBUS0) U22.1(B2)
JTAG_TCK: U14.16(ADBUS0) ; port USB_JTAG.USB_TCK  [also labelled TTL_TXD1/TCK, USB_TCK]
JTAG_TDI: U14.17(ADBUS1) ; port USB_JTAG.USB_TDI  [also labelled TTL_RXD1/TDI, USB_TDI]
JTAG_TDO: U14.18(ADBUS2) ; port USB_JTAG.USB_TDO  [also labelled TTL_RTS1/TDO, USB_TDO]
JTAG_TMS: U14.19(ADBUS3) ; port USB_JTAG.USB_TMS  [also labelled TTL_CTS1/TMS, USB_TMS]
PWREN: R155.1 U14.60(PWREN#)
TTL_CTS2: U14.29(BDBUS3)
TTL_CTS3: U14.41(CDBUS3)
TTL_CTS4: U14.54(DDBUS3)
TTL_DCD1: U14.23(ADBUS6)
TTL_DCD2: U14.33(BDBUS6)
TTL_DCD3: U14.45(CDBUS6)
TTL_DCD4: U14.58(DDBUS6)
TTL_DSR1: U14.22(ADBUS5)
TTL_DSR2: U14.32(BDBUS5)
TTL_DSR3: U14.44(CDBUS5)
TTL_DSR4: U14.57(DDBUS5)
TTL_DTR1: U14.21(ADBUS4)
TTL_DTR2: U14.30(BDBUS4)
TTL_DTR3: U14.43(CDBUS4)
TTL_DTR4: U14.55(DDBUS4)
TTL_RI1: U14.24(ADBUS7)
TTL_RI2: U14.34(BDBUS7)
TTL_RI3: U14.46(CDBUS7)
TTL_RI4: U14.59(DDBUS7)
TTL_RTS2: U14.28(BDBUS2)
TTL_RTS3: U14.40(CDBUS2)
TTL_RTS4: U14.53(DDBUS2)
TTL_RXD2: U21.5(A1) ; port FT4232_UART.TTL_RXD2  [project net BANK35_L19_N]
TTL_RXD3: U22.5(A1) ; port FT4232_UART.TTL_RXD3  [project net BANK35_L20_N]
TTL_RXD4: U14.52(DDBUS1)
TTL_TXD2: U21.4(A2) ; port FT4232_UART.TTL_TXD2  [project net BANK35_L19_P]
TTL_TXD3: U22.4(A2) ; port FT4232_UART.TTL_TXD3  [project net BANK35_L20_P]
TTL_TXD4: U14.48(DDBUS0)
NetC157_2: C157.2 R147.1 USB_JTAG.0(SHIELD)
NetC170_2: C170.2 U14.2(OSCI) Y5.2
NetC171_2: C171.2 U14.3(OSCO) Y5.1
NetF4_2: F4.2 USB_JTAG.1(VCC)
NetR127_1: R127.1 U21.6(OE)
NetR128_1: R128.1 U22.6(OE)
NetR148_2: R148.2 R149.2 U14.14(RESET#)
NetR150_2: R150.2 U14.6(REF)
NetR151_1: R151.1 R154.1 U15.4(DO)

Not connected (* = marked no-connect by the designer): U14 36(SUSPEND#); USB_JTAG 4(ID)*

### Notes on the sheet
- 默认不启用USB供电
- MCU
- FT4232
- USB_JTAG And 2 UART
- USB_JTAG
- FT4232额外支持2路UART，连接在FPGA BANK35
  通信时注意BANK35IO电平
- FT4232_UART

### Library data of the parts
C156 = Cap: Capacitor; Value: 100pF; Published: 8-Jun-2000; LatestRevisionDate: 17-Jul-2002; LatestRevisionNote: Re-released for DXP Platform.; PackageReference: RAD-0.3; Publisher: Altium Limited; PackageDescription: Radial Cap, Thru-Hole; 2 Leads; 0.3 in Pin Spacing
C157 = Cap: Capacitor; Published: 8-Jun-2000; LatestRevisionDate: 17-Jul-2002; LatestRevisionNote: Re-released for DXP Platform.; PackageReference: RAD-0.3; Publisher: Altium Limited; PackageDescription: Radial Cap, Thru-Hole; 2 Leads; 0.3 in Pin Spacing
C158-C167 C169 = Cap-0603-100nF: 贴片电容; 序号: 686; 规格型号: 100nF ±10%; 最新成本: NC; 存货编码: Cap-0603-100nF; 存货名称: 贴片电容; 产地品牌: NC; value: 100nF
C168 = Cap-0603-10uF: 贴片电容; 序号: 691; 规格型号: 10uF ±10%; 最新成本: NC; 存货编码: Cap-0603-10uF; 存货名称: 贴片电容; 产地品牌: NC; value: 10uF
C170 C171 = Cap-0603-27pF: 贴片电容; 序号: 641; 规格型号: 27pF ±5%; 最新成本: NC; value: 27pF; 存货编码: Cap-0603-27pF; 存货名称: 贴片电容; 产地品牌: NC
F4 = PTC
R127 R128 R147 = Res1: Resistor; Value: 1K; Published: 8-Jun-2000; LatestRevisionDate: 17-Jul-2002; LatestRevisionNote: Re-released for DXP Platform.; PackageReference: AXIAL-0.3; Publisher: Altium Limited; PackageDescription: Axial Device, Thru-Hole; 2 Leads; 0.3 in Pin Spacing
R148 = RES-0603-1K: 贴片电阻; 序号: 245; 规格型号: 1KΩ ±1%; 最新成本: NC; 存货编码: RES-0603-1K; 存货名称: 贴片电阻; 产地品牌: NC; value: 1KΩ
R149 = RES-0603-100K: 贴片电阻; 序号: 292; 规格型号: 100KΩ ±1%; 最新成本: NC; 存货编码: RES-0603-100K; 存货名称: 贴片电阻; 产地品牌: NC; value: 100KΩ
R150 = RES-0603-12K: 贴片电阻; 序号: 270; 规格型号: 12KΩ ±1%; 最新成本: NC; 存货编码: RES-0603-12K; 存货名称: 贴片电阻; 产地品牌: NC; value: 12KΩ
R151-R153 R155 = RES-0603-10K: 贴片电阻; 序号: 268; 规格型号: 10KΩ ±1%; 最新成本: NC; 存货编码: RES-0603-10K; 存货名称: 贴片电阻; 产地品牌: NC; value: 10KΩ
R154 = RES-0603-2.2K: 贴片电阻; 序号: 252; 规格型号: 2.2KΩ ±1%; 最新成本: NC; 存货编码: RES-0603-2.2K; 存货名称: 贴片电阻; 产地品牌: NC; value: 2.2KΩ
U14 = FT4232HL: 序号: 91; 存货名称: IC; 最新成本: NC; 存货编码: FT4232HL; value: FT4232HL; 规格型号: FT4232HL; 产地品牌: NC
U15 = AT93C46DN: 序号: 92; 存货名称: IC; 最新成本: NC; 存货编码: AT93C46DN; value: AT93C46DN; 规格型号: AT93C46DN; 产地品牌: NC
U21 U22 = TXS0102DCUR: as U20 on sheet UART; Type: DEV; RefDes: RefDes; Copyright: Copyright (C) 2022 Ultra Librarian. All rights reserved.; Manufacturer_Part_Number: TXS0102DCUR
Y5 = XTAL-49/S_N-12MHz: 晶体; 序号: 838; 最新成本: NC; 存货编码: XTAL-49/S_N-12MHz; 存货名称: 晶体; 规格型号: 12MHz; 产地品牌: NC; value: 12MHz